# EAGLE design module_tester-v01 (EAGLE 9.6.2)

## Sheet 1 of 4
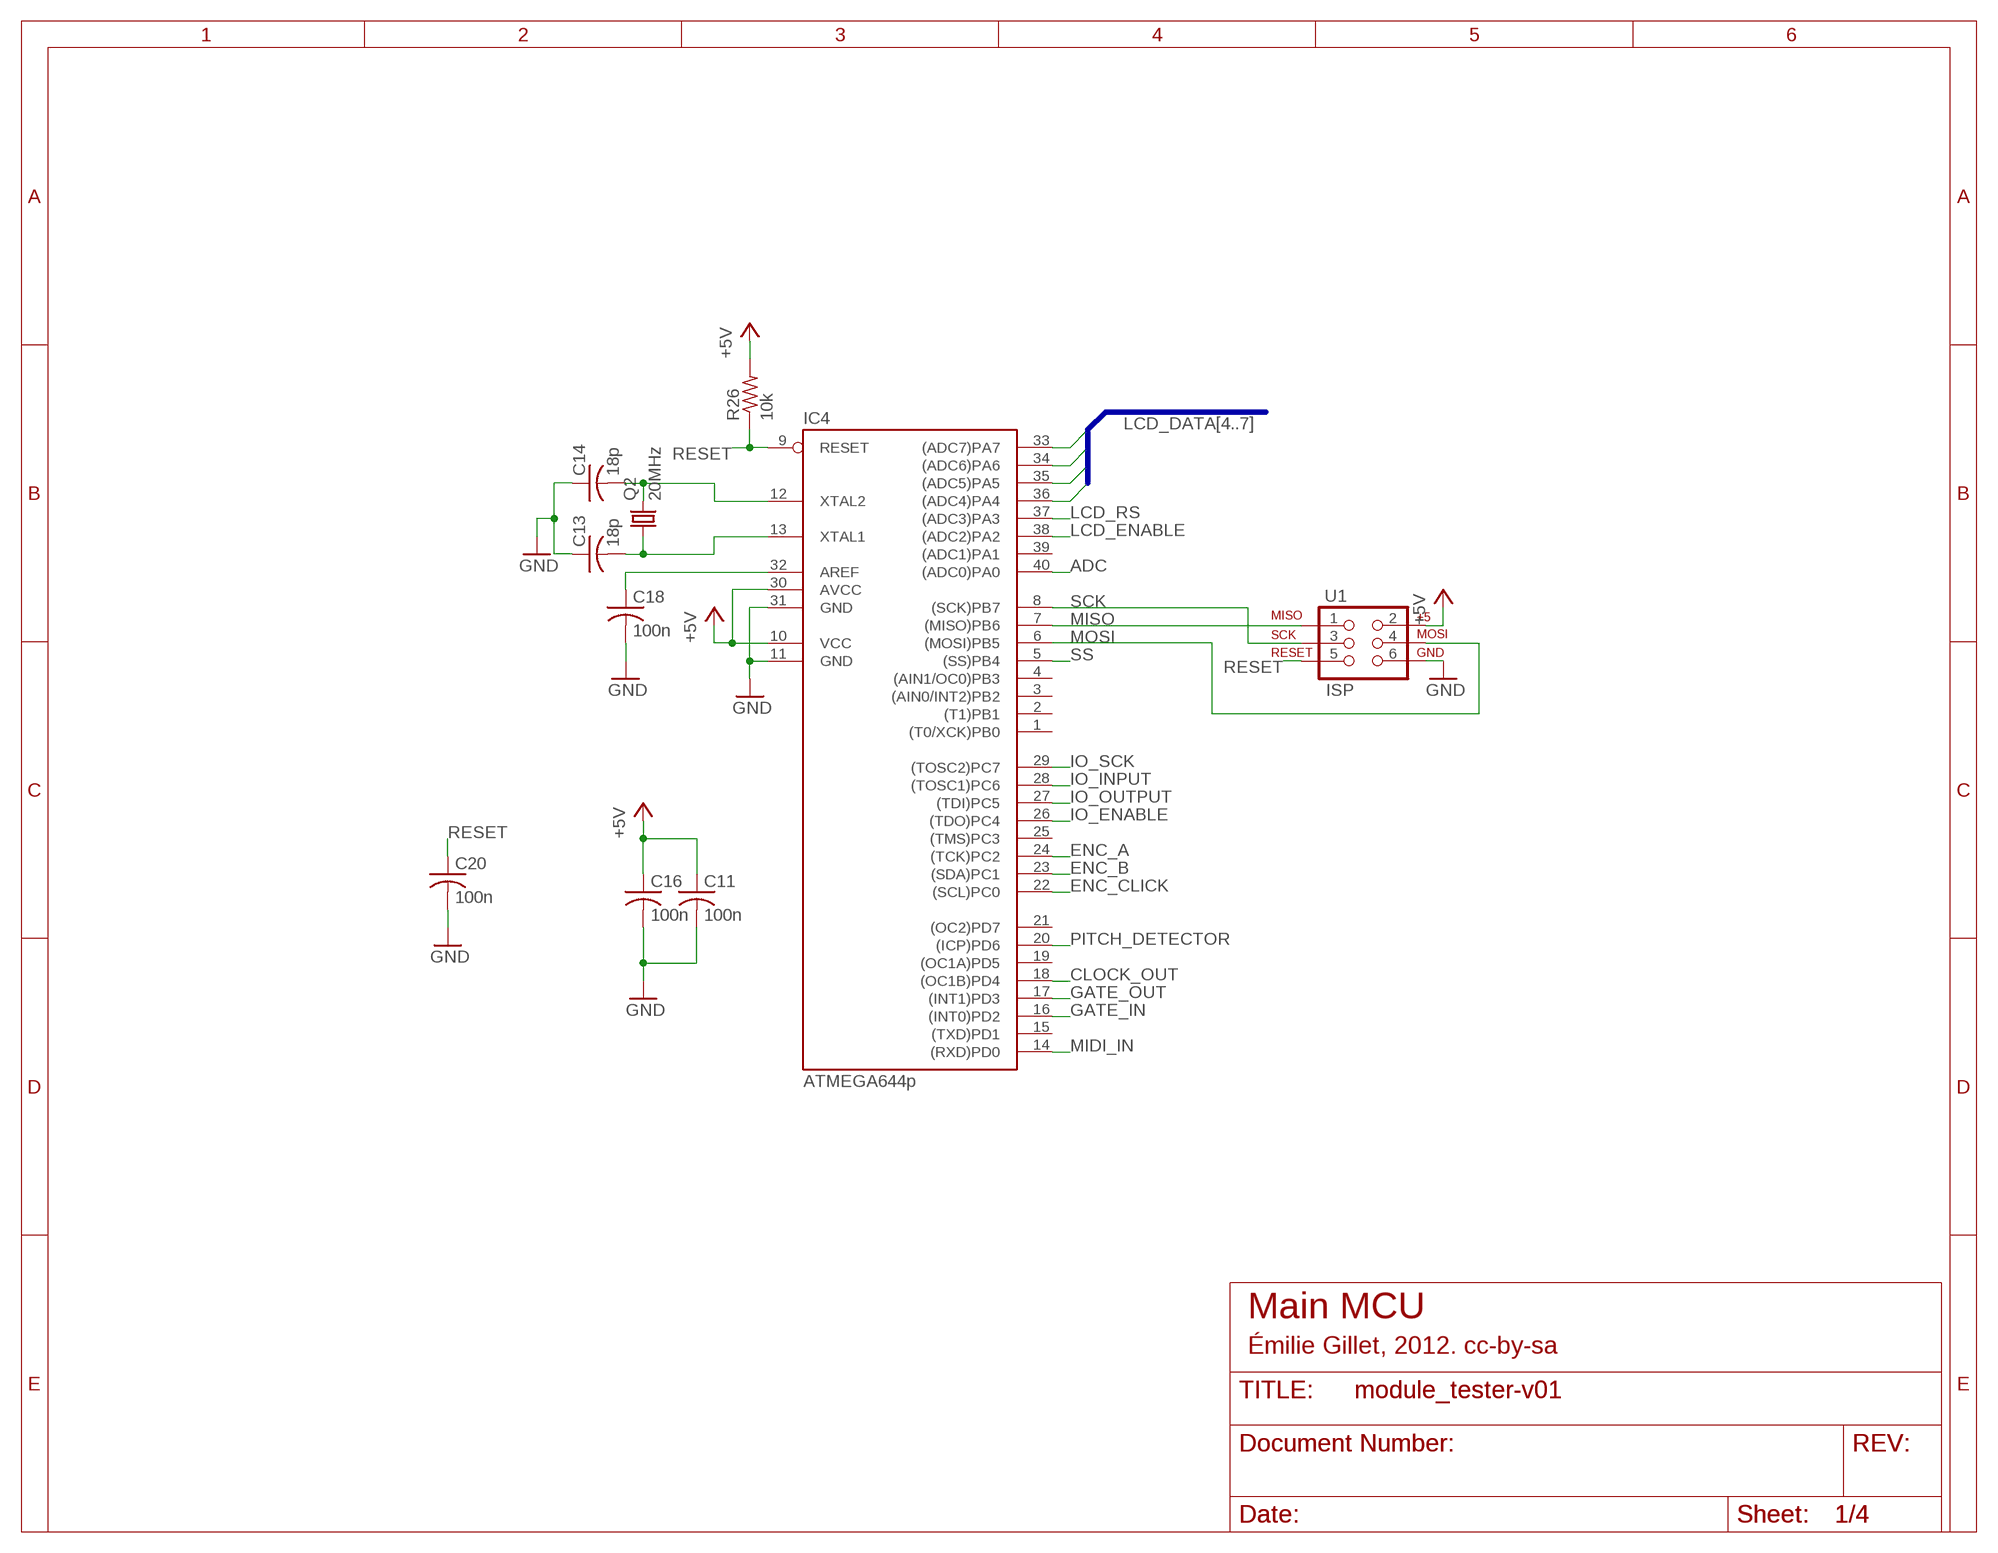
[diagram p0: schematic, sheet 1]

### Parts
C11  100n  C-US025-025X050  [C025-025X050]
C13  18p  C-US025-025X050  [C025-025X050]
C14  18p  C-US025-025X050  [C025-025X050]
C16  100n  C-US025-025X050  [C025-025X050]
C18  100n  C-US025-025X050  [C025-025X050]
C20  100n  C-US025-025X050  [C025-025X050]
IC4  ATMEGA644p  MEGA16-P  [DIL40]
Q2  20MHz  CRYSTALHC49U-V  [HC49U-V]
R26  10k  R-US_0204/7  [0204/7]
U1  ISP  AVR_SPI_PRG_6PTH  [2X3]

### Nets
+5V: C11.1 C16.1 IC4.10(VCC) IC4.30(AVCC) R26.2 U1.2 ; also sheet 2,3,4
ADC: IC4.40((ADC0)PA0) ; also sheet 3
CLOCK_OUT: IC4.18((OC1B)PD4) ; also sheet 2
ENC_A: IC4.24((TCK)PC2) ; also sheet 2
ENC_B: IC4.23((SDA)PC1) ; also sheet 2
ENC_CLICK: IC4.22((SCL)PC0) ; also sheet 2
GATE_IN: IC4.16((INT0)PD2) ; also sheet 2
GATE_OUT: IC4.17((INT1)PD3) ; also sheet 2
GND: C11.2 C13.1 C14.1 C16.2 C18.2 C20.2 IC4.11(GND) IC4.31(GND) U1.6 ; also sheet 2,3,4
IO_ENABLE: IC4.26((TDO)PC4) ; also sheet 2
IO_INPUT: IC4.28((TOSC1)PC6) ; also sheet 2
IO_OUTPUT: IC4.27((TDI)PC5) ; also sheet 2
IO_SCK: IC4.29((TOSC2)PC7) ; also sheet 2
LCD_DATA4: IC4.36((ADC4)PA4) ; also sheet 2
LCD_DATA5: IC4.35((ADC5)PA5) ; also sheet 2
LCD_DATA6: IC4.34((ADC6)PA6) ; also sheet 2
LCD_DATA7: IC4.33((ADC7)PA7) ; also sheet 2
LCD_ENABLE: IC4.38((ADC2)PA2) ; also sheet 2
LCD_RS: IC4.37((ADC3)PA3) ; also sheet 2
MIDI_IN: IC4.14((RXD)PD0) ; also sheet 2
MISO: IC4.7((MISO)PB6) U1.1
MOSI: IC4.6((MOSI)PB5) U1.4 ; also sheet 3
N$7: C18.1 IC4.32(AREF)
N$82: C13.2 IC4.13(XTAL1) Q2.1
N$83: C14.2 IC4.12(XTAL2) Q2.2
PITCH_DETECTOR: IC4.20((ICP)PD6) ; also sheet 3
RESET: C20.1 IC4.9(RESET) R26.1 U1.5
SCK: IC4.8((SCK)PB7) U1.3 ; also sheet 3
SS: IC4.5((SS)PB4) ; also sheet 3
Unconnected: IC4.1((T0/XCK)PB0) IC4.2((T1)PB1) IC4.3((AIN0/INT2)PB2) IC4.4((AIN1/OC0)PB3) IC4.15((TXD)PD1) IC4.19((OC1A)PD5) IC4.21((OC2)PD7) IC4.25((TMS)PC3) IC4.39((ADC1)PA1)

### Buses
LCD_DATA[4..7]

### Notes on the sheet
- Main MCU
- Émilie Gillet, 2012. cc-by-sa

## Sheet 2 of 4
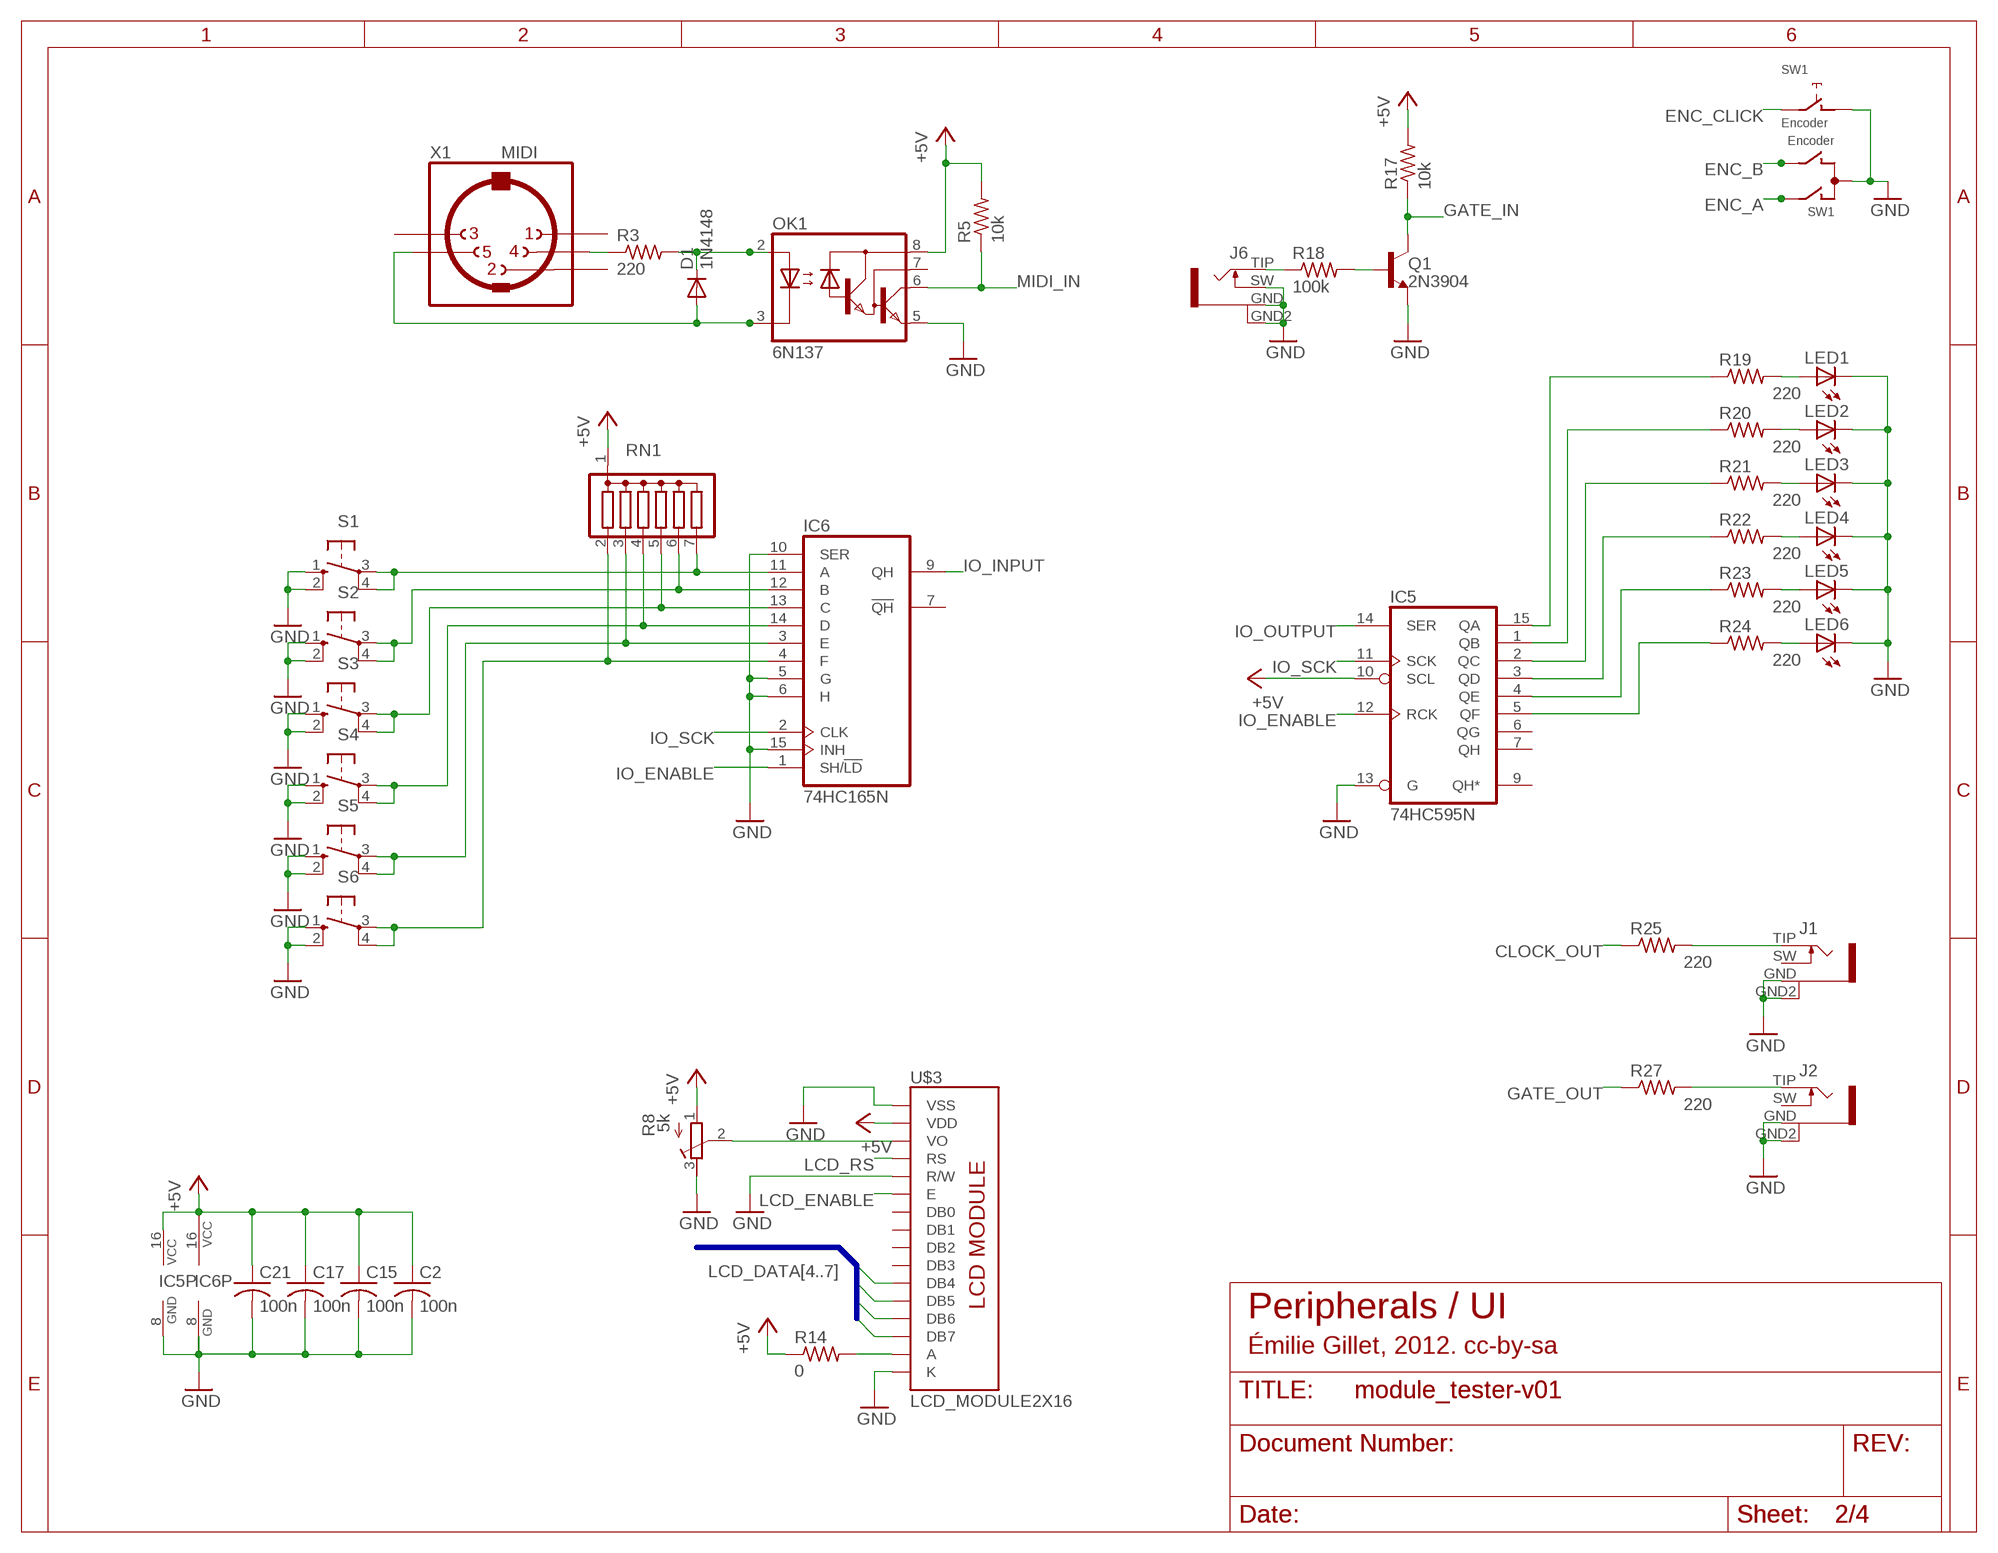
[diagram p1: schematic, sheet 2]

### Parts
C2  100n  C-US025-025X050  [C025-025X050]
C15  100n  C-US025-025X050  [C025-025X050]
C17  100n  C-US025-025X050  [C025-025X050]
C21  100n  C-US025-025X050  [C025-025X050]
D1  1N4148  DIODE-D-5  [D-5]
IC5  74HC595N  [DIL16]
IC6  74HC165N  74LS165N  [DIL16]
J1  PJ301WQP  [WQP_PJ_301BM]
J2  PJ301WQP  [WQP_PJ_301BM]
J6  PJ301WQP  [WQP_PJ_301BM]
LED1  LED3MM  [LED3MM]
LED2  LED3MM  [LED3MM]
LED3  LED3MM  [LED3MM]
LED4  LED3MM  [LED3MM]
LED5  LED3MM  [LED3MM]
LED6  LED3MM  [LED3MM]
OK1  6N137  6N138  [DIL08]
Q1  2N3904  [TO92-]
R3  220  R-US_0204/7  [0204/7]
R5  10k  R-US_0204/7  [0204/7]
R8  5k  R-TRIMM3339P  [RTRIM3339P]
R14  0  R-US_0204/7  [0204/7]
R17  10k  R-US_0204/7  [0204/7]
R18  100k  R-US_0204/7  [0204/7]
R19  220  R-US_0204/7  [0204/7]
R20  220  R-US_0204/7  [0204/7]
R21  220  R-US_0204/7  [0204/7]
R22  220  R-US_0204/7  [0204/7]
R23  220  R-US_0204/7  [0204/7]
R24  220  R-US_0204/7  [0204/7]
R25  220  R-US_0204/7  [0204/7]
R27  220  R-US_0204/7  [0204/7]
RN1  G06R  [SIL7]
S1  40-XX  [B3F-40XX]
S2  40-XX  [B3F-40XX]
S3  40-XX  [B3F-40XX]
S4  40-XX  [B3F-40XX]
S5  40-XX  [B3F-40XX]
S6  40-XX  [B3F-40XX]
SW1  Encoder  EC12E_SW  [ALPS_EC12E_SW]
U$3  LCD_MODULE2X16  [LCD_MODULE_2X16]
X1  MIDI  MAB5SH  [MAB5SH]

### Nets
+5V: C2.1 C15.1 C17.1 C21.1 IC5.10(SCL) IC5.16(VCC) IC6.16(VCC) OK1.8(VCC) R5.2 R8.1(E) R14.1 R17.2 RN1.1 U$3.2(VDD) ; also sheet 1,3,4
CLOCK_OUT: R25.1 ; also sheet 1
ENC_A: SW1.A ; also sheet 1
ENC_B: SW1.B ; also sheet 1
ENC_CLICK: SW1.E ; also sheet 1
GATE_IN: Q1.1(C) R17.1 ; also sheet 1
GATE_OUT: R27.1 ; also sheet 1
GND: C2.2 C15.2 C17.2 C21.2 IC5.8(GND) IC5.13(G) IC6.5(G) IC6.6(H) IC6.8(GND) IC6.10(SER) IC6.15(INH) J1.GND J1.GND2 J2.GND J2.GND2 J6.GND J6.GND2 J6.SW LED1.K(C) LED2.K(C) LED3.K(C) LED4.K(C) LED5.K(C) LED6.K(C) OK1.5(GND) Q1.3(E) R8.3(A) S1.1(S) S1.2(S1) S2.1(S) S2.2(S1) S3.1(S) S3.2(S1) S4.1(S) S4.2(S1) S5.1(S) S5.2(S1) S6.1(S) S6.2(S1) SW1.C SW1.D U$3.1(VSS) U$3.5(R/W) U$3.16(K) ; also sheet 1,3,4
IO_ENABLE: IC5.12(RCK) IC6.1(SH/!LD) ; also sheet 1
IO_INPUT: IC6.9(QH) ; also sheet 1
IO_OUTPUT: IC5.14(SER) ; also sheet 1
IO_SCK: IC5.11(SCK) IC6.2(CLK) ; also sheet 1
LCD_DATA4: U$3.11(DB4) ; also sheet 1
LCD_DATA5: U$3.12(DB5) ; also sheet 1
LCD_DATA6: U$3.13(DB6) ; also sheet 1
LCD_DATA7: U$3.14(DB7) ; also sheet 1
LCD_ENABLE: U$3.6(E) ; also sheet 1
LCD_RS: U$3.4(RS) ; also sheet 1
MIDI_IN: OK1.6(VO) R5.1 ; also sheet 1
N$1: IC5.2(QC) R21.1
N$2: IC5.4(QE) R23.1
N$3: LED5.A R23.2
N$5: J6.TIP R18.1
N$9: IC6.3(E) RN1.3 S5.3(P) S5.4(P1)
N$11: J1.TIP R25.2
N$12: IC6.4(F) RN1.2 S6.3(P) S6.4(P1)
N$13: IC6.14(D) RN1.4 S4.3(P) S4.4(P1)
N$14: J2.TIP R27.2
N$18: R8.2(S) U$3.3(VO)
N$19: LED6.A R24.2
N$21: IC5.5(QF) R24.1
N$24: IC6.11(A) RN1.7 S1.3(P) S1.4(P1)
N$28: D1.C OK1.2(A) R3.2
N$30: IC5.15(QA) R19.1
N$31: IC5.1(QB) R20.1
N$33: IC5.3(QD) R22.1
N$42: LED1.A R19.2
N$43: LED2.A R20.2
N$44: LED3.A R21.2
N$45: LED4.A R22.2
N$66: Q1.2(B) R18.2
N$72: R3.1 X1.4
N$73: D1.A OK1.3(C) X1.5
N$79: R14.2 U$3.15(A)
N$88: IC6.12(B) RN1.6 S2.3(P) S2.4(P1)
N$90: IC6.13(C) RN1.5 S3.3(P) S3.4(P1)
Unconnected: IC5.6(QG) IC5.7(QH) IC5.9(QH*) IC6.7(!QH) J1.SW J2.SW OK1.7(VB) SW1.GND1(G) SW1.GND2(G) U$3.7(DB0) U$3.8(DB1) U$3.9(DB2) U$3.10(DB3) X1.1 X1.2 X1.3

### Buses
LCD_DATA[4..7]

### Notes on the sheet
- Peripherals / UI
- Émilie Gillet, 2012. cc-by-sa

## Sheet 3 of 4
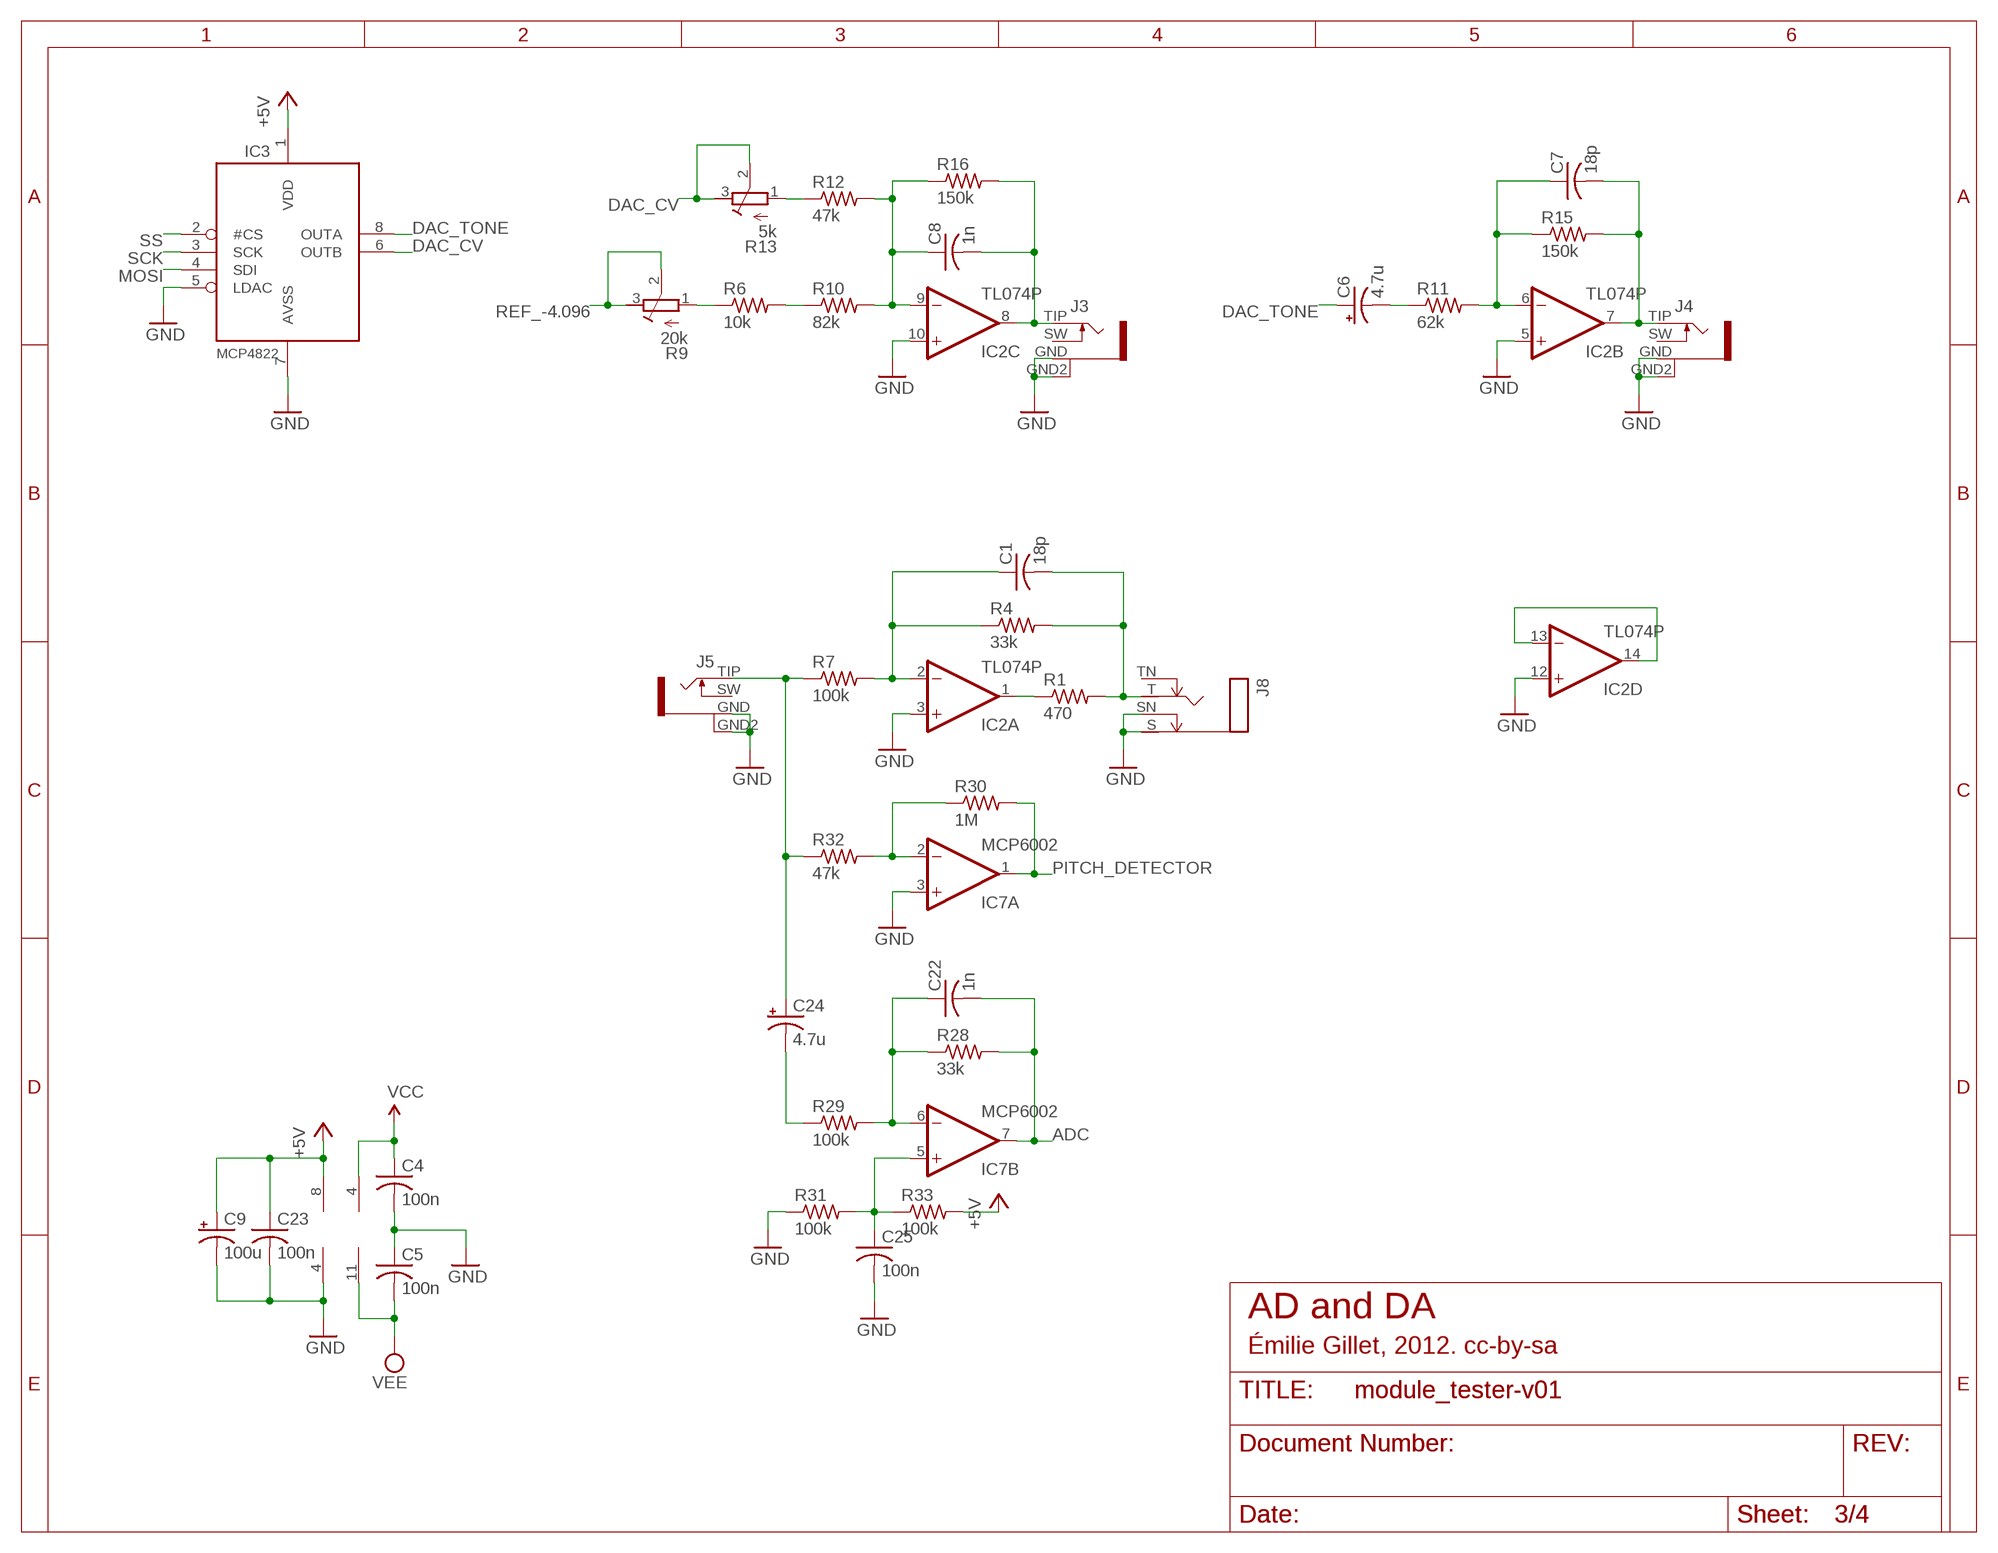
[diagram p2: schematic, sheet 3]

### Parts
C1  18p  C-US025-025X050  [C025-025X050]
C4  100n  C-US025-025X050  [C025-025X050]
C5  100n  C-US025-025X050  [C025-025X050]
C6  4.7u  CPOL-USE2.5-6  [E2,5-6]
C7  18p  C-US025-025X050  [C025-025X050]
C8  1n  C-US025-025X050  [C025-025X050]
C9  100u  CPOL-USE2.5-7  [E2,5-7]
C22  1n  C-US025-025X050  [C025-025X050]
C23  100n  C-US025-025X050  [C025-025X050]
C24  4.7u  CPOL-USE2.5-6  [E2,5-6]
C25  100n  C-US025-025X050  [C025-025X050]
IC2  TL074P  [DIL14]
IC3  MCP4822  [DIL08]
IC7  MCP6002  TL072P  [DIL08]
J3  PJ301WQP  [WQP_PJ_301BM]
J4  PJ301WQP  [WQP_PJ_301BM]
J5  PJ301WQP  [WQP_PJ_301BM]
J8  MONOSWSLIM  [NRJ4HF]
R1  470  R-US_0204/7  [0204/7]
R4  33k  R-US_0204/7  [0204/7]
R6  10k  R-US_0204/7  [0204/7]
R7  100k  R-US_0204/7  [0204/7]
R9  20k  R-TRIMM3296W  [RTRIM3296W]
R10  82k  R-US_0204/7  [0204/7]
R11  62k  R-US_0204/7  [0204/7]
R12  47k  R-US_0204/7  [0204/7]
R13  5k  R-TRIMM3296W  [RTRIM3296W]
R15  150k  R-US_0204/7  [0204/7]
R16  150k  R-US_0204/7  [0204/7]
R28  33k  R-US_0204/7  [0204/7]
R29  100k  R-US_0204/7  [0204/7]
R30  1M  R-US_0204/7  [0204/7]
R31  100k  R-US_0204/7  [0204/7]
R32  47k  R-US_0204/7  [0204/7]
R33  100k  R-US_0204/7  [0204/7]

### Nets
+5V: C9.+ C23.1 IC3.1(VDD) IC7.8(P:V+) R33.2 ; also sheet 1,2,4
ADC: C22.2 IC7.7(B:OUT) R28.2 ; also sheet 1
DAC_CV: IC3.6(OUTB) R13.2(S) R13.3(A)
DAC_TONE: C6.+ IC3.8(OUTA)
GND: C4.2 C5.1 C9.- C23.2 C25.2 IC2.3(A:+IN) IC2.5(B:+IN) IC2.10(C:+IN) IC2.12(D:+IN) IC3.5(LDAC) IC3.7(AVSS) IC7.3(A:+IN) IC7.4(P:V-) J3.GND J3.GND2 J4.GND J4.GND2 J5.GND J5.GND2 J8.S J8.SN R31.1 ; also sheet 1,2,4
MOSI: IC3.4(SDI) ; also sheet 1
N$6: C24.+ J5.TIP R7.1 R32.1
N$15: C1.1 IC2.2(A:-IN) R4.1 R7.2
N$16: C1.2 J8.T R1.2 R4.2
N$17: C6.- R11.1
N$23: C7.1 IC2.6(B:-IN) R11.2 R15.1
N$26: C8.2 IC2.8(C:OUT) J3.TIP R16.2
N$27: C8.1 IC2.9(C:-IN) R10.2 R12.2 R16.1
N$29: R12.1 R13.1(E)
N$32: R6.1 R9.1(E)
N$35: R6.2 R10.1
N$36: C25.1 IC7.5(B:+IN) R31.2 R33.1
N$37: IC7.2(A:-IN) R30.1 R32.2
N$38: C22.1 IC7.6(B:-IN) R28.1 R29.2
N$40: C24.- R29.1
N$41: IC2.13(D:-IN) IC2.14(D:OUT)
N$81: IC2.1(A:OUT) R1.1
PITCH_DETECTOR: IC7.1(A:OUT) R30.2 ; also sheet 1
REF_-4.096: R9.2(S) R9.3(A) ; also sheet 4
SCK: IC3.3(SCK) ; also sheet 1
SS: IC3.2(#CS) ; also sheet 1
TONE_OUT: C7.2 IC2.7(B:OUT) J4.TIP R15.2
VCC: C4.1 IC2.4(P:V+) ; also sheet 4
VEE: C5.2 IC2.11(P:V-) ; also sheet 4
Unconnected: J3.SW J4.SW J5.SW J8.TN

### Notes on the sheet
- AD and DA
- Émilie Gillet, 2012. cc-by-sa

## Sheet 4 of 4
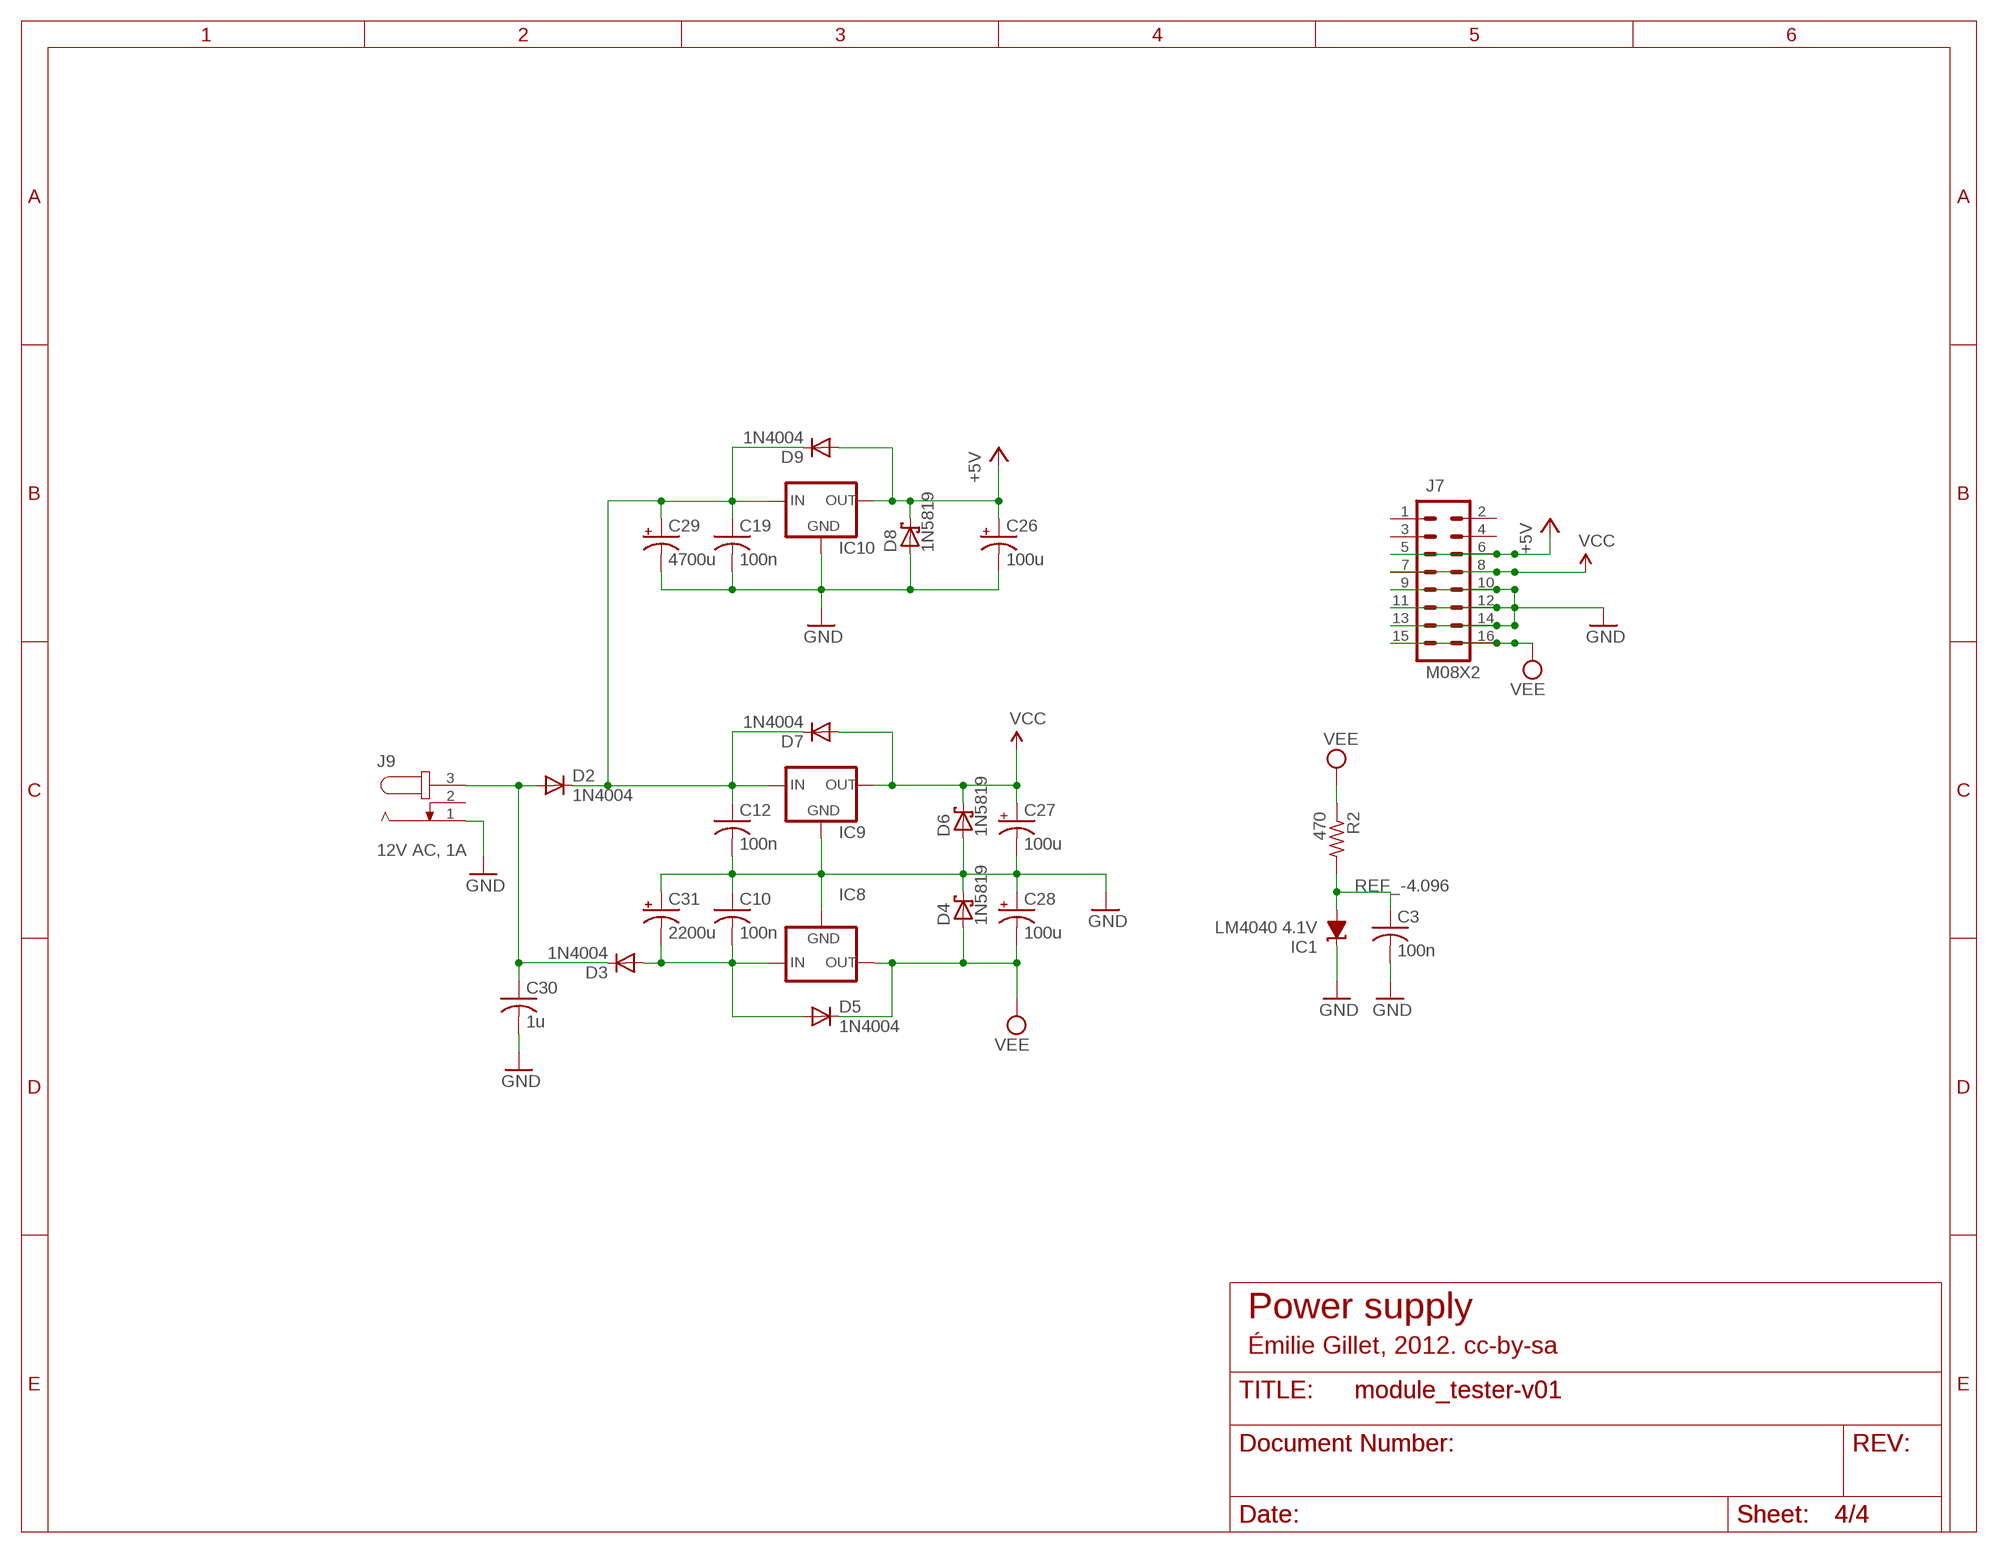
[diagram p3: schematic, sheet 4]

### Parts
C3  100n  C-US025-025X050  [C025-025X050]
C10  100n  C-US025-025X050  [C025-025X050]
C12  100n  C-US025-025X050  [C025-025X050]
C19  100n  C-US025-025X050  [C025-025X050]
C26  100u  CPOL-USE2.5-7  [E2,5-7]
C27  100u  CPOL-USE2.5-7  [E2,5-7]
C28  100u  CPOL-USE2.5-7  [E2,5-7]
C29  4700u  CPOL-USE7.5-16  [E7,5-16]
C30  1u  C-US075-052X106  [C075-052X106]
C31  2200u  CPOL-USE5-13  [E5-13]
D2  1N4004  [DO41-10]
D3  1N4004  [DO41-10]
D4  1N5819  1N5819-T  [DO41-7.6]
D5  1N4004  [DO41-10]
D6  1N5819  1N5819-T  [DO41-7.6]
D7  1N4004  [DO41-10]
D8  1N5819  1N5819-T  [DO41-7.6]
D9  1N4004  [DO41-10]
IC1  LM4040 4.1V  LM4041C12LP  [LP_O-PBCY-W3]
IC8  79XXL  [79XXL]
IC9  78XXL  [78XXL]
IC10  78XXL  [78XXL]
J7  M08X2  [2X8]
J9  JACK-PLUG2  [SPC4078_BIG_HOLES]
R2  470  R-US_0204/7  [0204/7]

### Nets
+5V: C26.+ D8.C D9.A IC10.OUT J7.5 J7.6 ; also sheet 1,2,3
GND: C3.2 C10.1 C12.2 C19.2 C26.- C27.- C28.+ C29.- C30.2 C31.+ D4.C D6.A D8.A IC1.2(C) IC8.GND IC9.GND IC10.GND J7.9 J7.10 J7.11 J7.12 J7.13 J7.14 J9.1 ; also sheet 1,2,3
N$4: C30.1 D2.A D3.C J9.3
N$20: C10.2 C31.- D3.A D5.A IC8.IN
N$25: C12.1 C19.1 C29.+ D2.C D7.C D9.C IC9.IN IC10.IN
REF_-4.096: C3.1 IC1.3(A) R2.2 ; also sheet 3
VCC: C27.+ D6.C D7.A IC9.OUT J7.7 J7.8 ; also sheet 3
VEE: C28.- D4.A D5.C IC8.OUT J7.15 J7.16 R2.1 ; also sheet 3
Unconnected: J7.1 J7.2 J7.3 J7.4 J9.2

### Notes on the sheet
- 12V AC, 1A
- Power supply
- Émilie Gillet, 2012. cc-by-sa

## Library data of the parts
C1-C5 C7 C8 C10-C23 C25 C30 = rcl:C-US: CAPACITOR, American symbol
C6 C9 C24 C26-C29 C31 = rcl:CPOL-US: POLARIZED CAPACITOR, American symbol
D1 = diode:DIODE-: DIODE
D2 D3 D5 D7 D9 = diode:1N4004: DIODE general purpose rectifier, 1 A
D4 D6 D8 = diode:1N581*: 1.0A SCHOTTKY BARRIER RECTIFIER Source: http://www.diodes.com/datasheets/ds23001.pdf
IC1 = texas:LM4041: PRECISION MICROPOWER SHUNT VOLTAGE REFERENCE Source: http://focus.ti.com/lit/ds/slcs146e/slcs146e.pdf
IC2 = linear:TL074: OP AMP
IC3 = og-dac:MCP4822
IC4 = atmel:MEGA16-P: MICROCONTROLLER 16 Kbytes FLASH 1 kbytes SRAM 512 bytes EEPROM USART 8-channel 10 bit ADC Source: avr.lbr
IC5 = 74xx-eu:74*595: 8-bit SHIFT REGISTER, output latch
IC6 = 74xx-us:74*165: 8-bit parallel load SHIFT REGISTER
IC7 = og-linear:TL072: OP AMP
IC8 = v-reg:79XXL: VOLTAGE REGULATOR
IC9 IC10 = v-reg:78XXL: VOLTAGE REGULATOR
J1-J6 = og-pj301:PJ301
J7 = og-header:M08X2
J8 = og-neutrik:MONOSW
J9 = con-jack2:JACK-PLUG: DC POWER JACK Power Jack, DC, Right Angle, Through Hole, Rated 5A at 16VDC, PC Terminals Distributor: Farnell (www.Farnell.de) Drawing: 84N1161.pdf / 84N1162.pdf Manufacturer: SPC Technology (www.spctechnology.com) Type: SPC4077 / SPC 4078
LED1-LED6 = led:LED: LED OSRAM: - CHIPLED LG R971, LG N971, LY N971, LG Q971, LY Q971, LO R971, LY R971 LH N974, LH R974 LS Q976, LO Q976, LY Q976 LO Q996 - Hyper CHIPLED LW Q18S LB Q993, LB Q99A, LB R99A - SideLED LS A670, LO A670, LY A670, LG A670, LP A670 LB A673, LV A673, LT A673, LW A673 LH A674 LY A675 LS A676, LA A676, LO A676, LY A676, LW A676 LS A679, LY A679, LG A679 - Hyper Micro SIDELED® LS Y876, LA Y876, LO Y876, LY Y876 LT Y87S - SmartLED LW L88C, LW L88S LB L89C, LB L89S, LG L890 LS L89K, LO L89K, LY L89K LS L896, LA L896, LO L896, LY L896 - TOPLED LS T670, LO T670, LY T670, LG T670, LP T670 LSG T670, LSP T670, LSY T670, LOP T670, LYG T670 LG T671, LOG T671, LSG T671 LB T673, LV T673, LT T673, LW T673 LH T674 LS T676, LA T676, LO T676, LY T676, LB T676, LH T676, LSB T676, LW T676 LB T67C, LV T67C, LT T67C, LS T67K, LO T67K, LY T67K, LW E67C LS E67B, LA E67B, LO E67B, LY E67B, LB E67C, LV E67C, LT E67C LW T67C LS T679, LY T679, LG T679 LS T770, LO T770, LY T770, LG T770, LP T770 LB T773, LV T773, LT T773, LW T773 LH T774 LS E675, LA E675, LY E675, LS T675 LS T776, LA T776, LO T776, LY T776, LB T776 LHGB T686 LT T68C, LB T68C - Hyper Mini TOPLED® LB M676 - Mini TOPLED Santana® LG M470 LS M47K, LO M47K, LY M47K Source: http://www.osram.convergy.de LUXEON: - LUMILED® LXK2-PW12-R00, LXK2-PW12-S00, LXK2-PW14-U00, LXK2-PW14-V00 LXK2-PM12-R00, LXK2-PM12-S00, LXK2-PM14-U00 LXK2-PE12-Q00, LXK2-PE12-R00, LXK2-PE12-S00, LXK2-PE14-T00, LXK2-PE14-U00 LXK2-PB12-K00, LXK2-PB12-L00, LXK2-PB12-M00, LXK2-PB14-N00, LXK2-PB14-P00, LXK2-PB14-Q00 LXK2-PR12-L00, LXK2-PR12-M00, LXK2-PR14-Q00, LXK2-PR14-R00 LXK2-PD12-Q00, LXK2-PD12-R00, LXK2-PD12-S00 LXK2-PH12-R00, LXK2-PH12-S00 LXK2-PL12-P00, LXK2-PL12-Q00, LXK2-PL12-R00 Source: www.luxeon.com KINGBRIGHT: KA-3528ASYC Source: www.kingbright.com
OK1 = optocoupler:6N138: MOTOROLA OPTO COUPLER
Q1 = gm-trans:2N3904: NPN Transistor
Q2 = crystal:CRYSTAL: CRYSTAL
R1 R3-R7 R10-R12 R14-R33 = rcl:R-US_: RESISTOR, American symbol
R2 = resistor:R-US_: RESISTOR, American symbol
R8 R9 R13 = rcl:R-TRIMM: Trimm resistor
RN1 = resistor-sil:G06R: SIL RESISTOR
S1-S6 = og-switch:40-XX: OMRON SWITCH
SW1 = switch-alps:EC12E_SW: ALPS rotary Encoder EC12E series with switch
U1 = SparkFun:AVR_SPI_PRG_6: AVR ISP 6 Pin This is the reduced ISP connector for AVR programming. Common on Arduino. This footprint will take up less PCB space and can be used with a 10-pin to 6-pin adapter such as SKU: BOB-08508
U$3 = og-lcd:LCD_MODULE: Character LCD module
X1 = og-midi:MAB5SH: Female CONNECTOR 5 pins 90 deg. with shield, horizontal (DIN 41524)

## Board
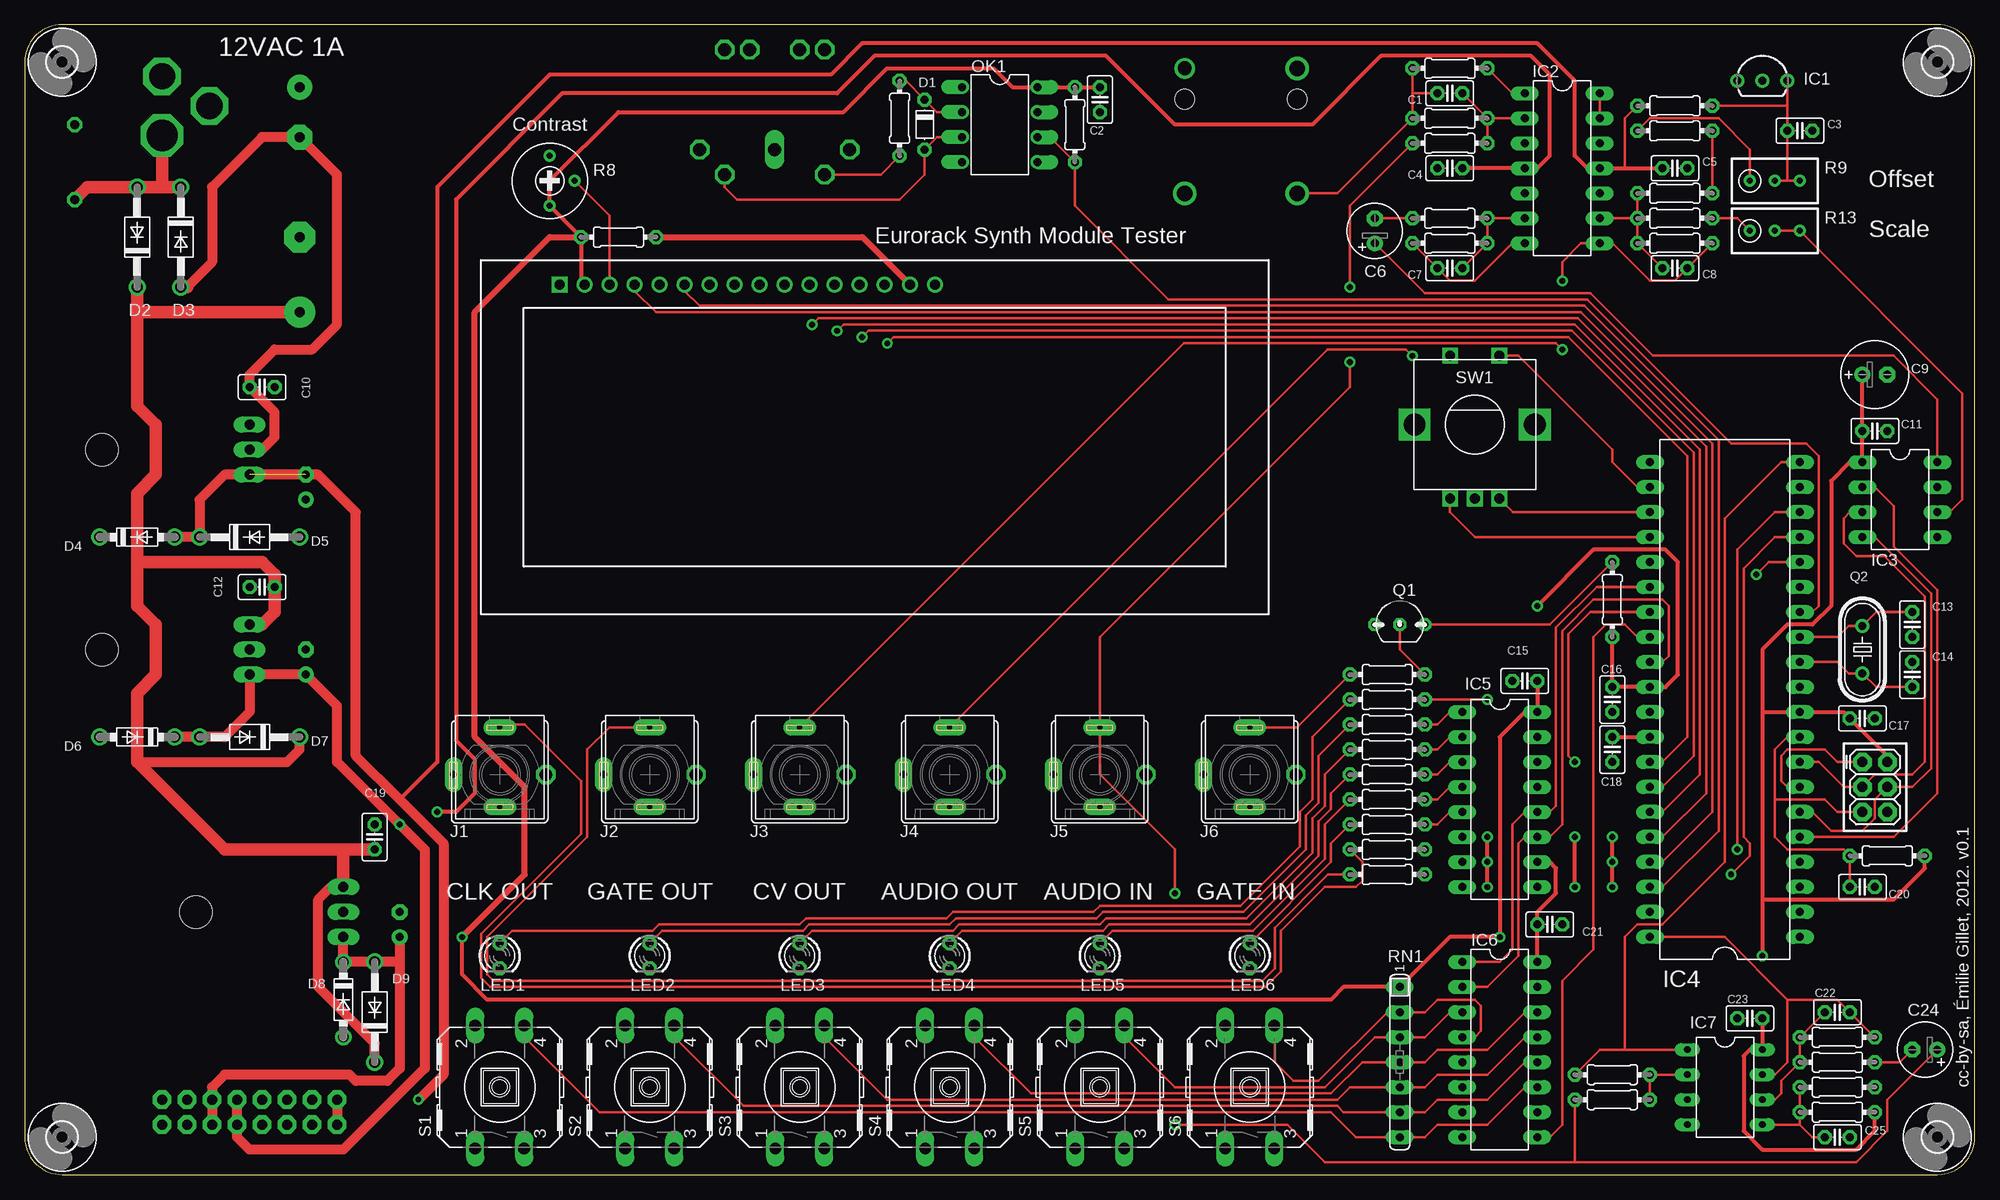
[diagram p4: board, top side]
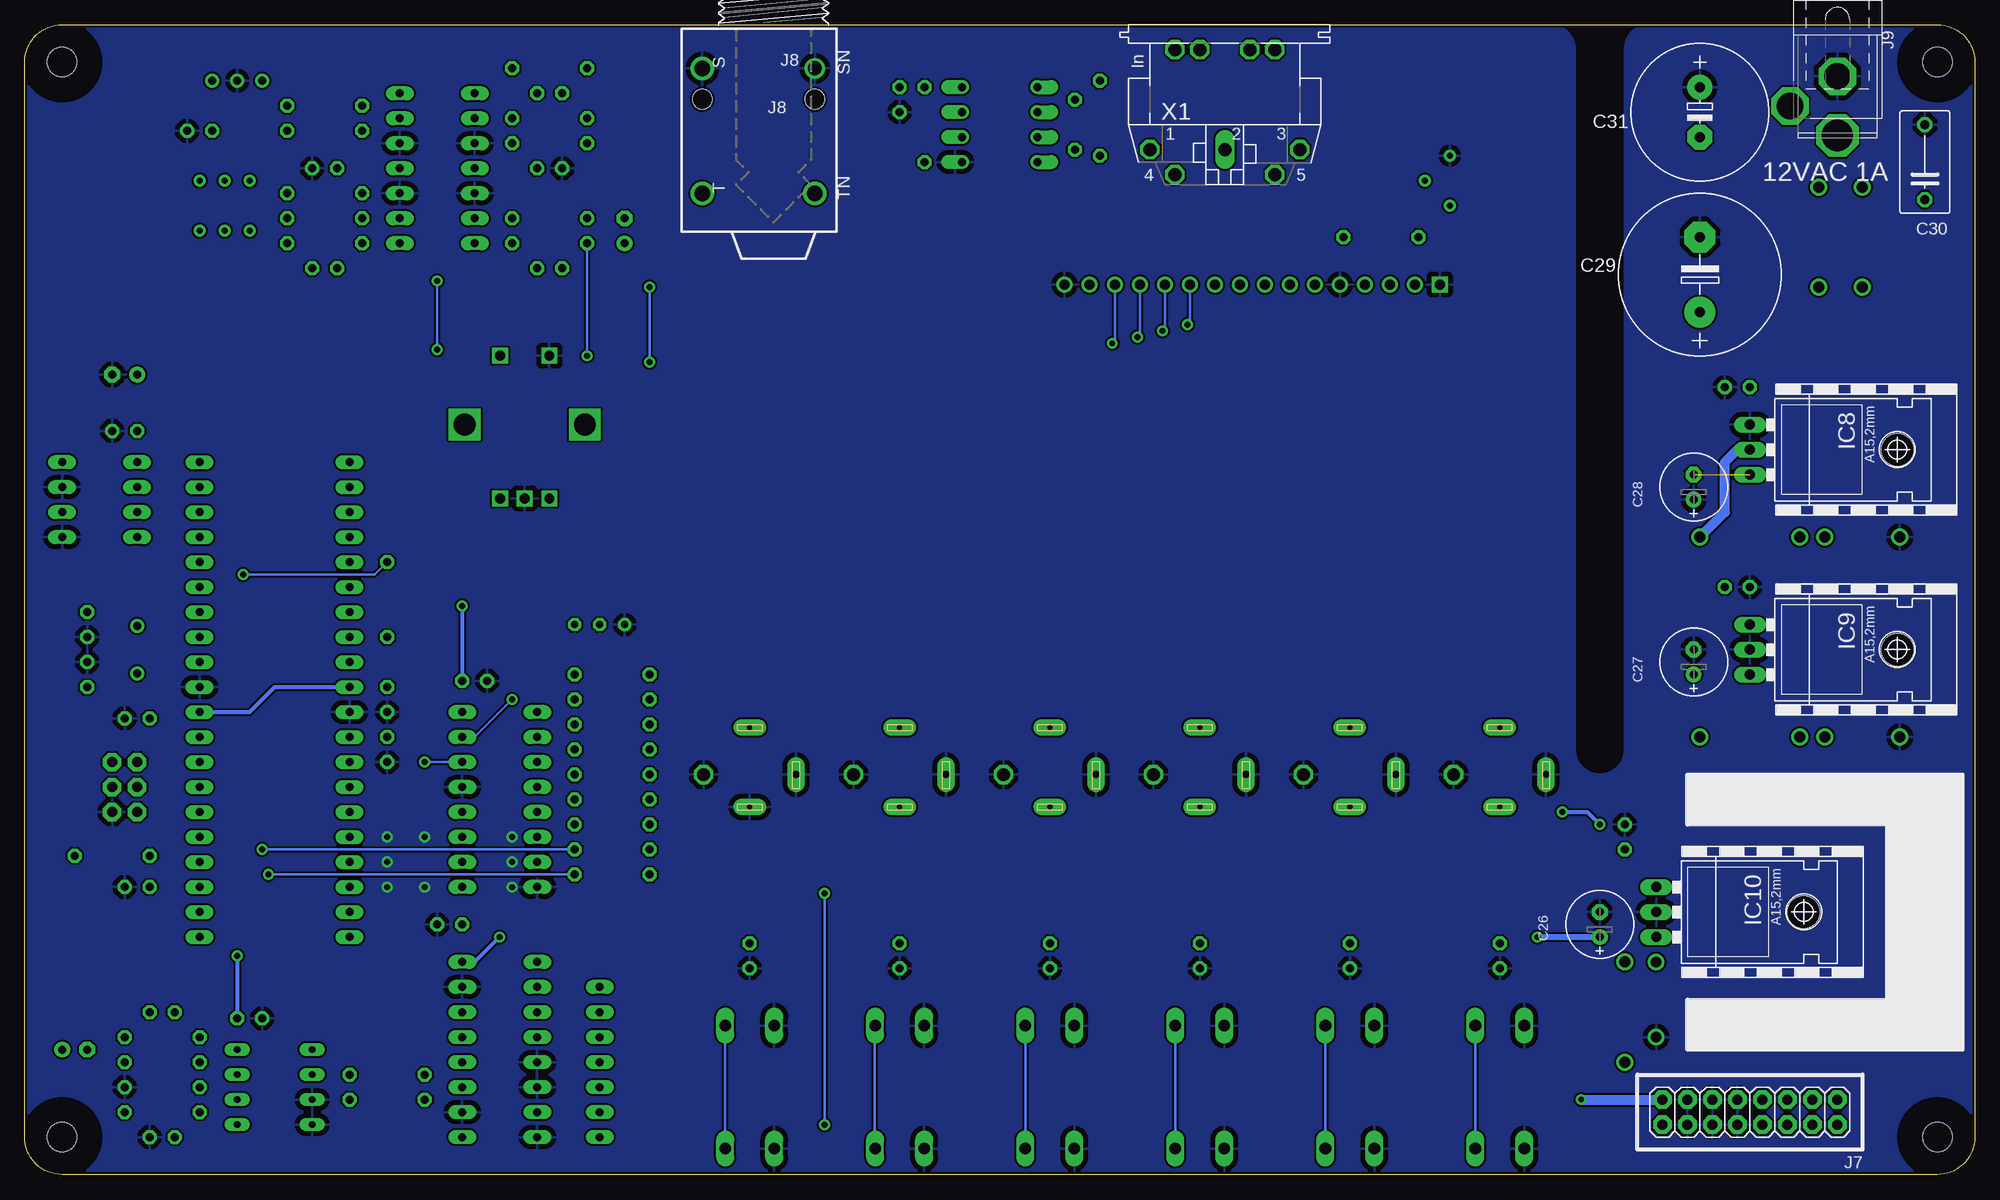
[diagram p5: board, bottom side, seen from below]

Size 198.12 x 116.84 mm. Coordinates in mm from the lower left corner, seen from the top.
Outline: 198.12,113.03 arc90 194.31,116.84 3.81,116.84 arc90 0,113.03 0,3.81 arc90 3.81,0 194.31,0 arc90 198.12,3.81 198.12,113.03
Copper layers (1*16): Top 0.035mm / dielectric 1.5mm / Bottom 0.035mm
Design rules "SparkFun *": minimum track width 8mil, minimum drill 20mil, track to track 8mil, track to pad 8mil, pad to pad 8mil, via to via 8mil, smd to smd 8mil, copper to edge 10mil, drill to drill 8mil, minimum pad ring 12mil, minimum via ring 10mil, stop-mask expansion 4mil, vias tented up to drill 25mil, thermal gap 20mil

### Footprints (pad centres in the part's own frame; a part is rotated, then mirrored left to right if it is on the bottom)
C025-025X050 = drill 0.813 octagon: 1 -1.27,0; 2 1.27,0
E2,5-6 = drill 0.813 pad 1.6: + -1.27,0 | drill 0.813 pad 1.6 octagon: - 1.27,0
E2,5-7 = drill 0.813 pad 1.6: + -1.27,0 | drill 0.813 pad 1.6 octagon: - 1.27,0
E7,5-16 = drill 1.016 pad 3.15: + -3.81,0 | drill 1.016 pad 3.15 octagon: - 3.81,0
C075-052X106 = drill 0.914 octagon: 1 -3.81,0; 2 3.81,0
E5-13 = drill 1.016 pad 2.54: + -2.54,0 | drill 1.016 pad 2.54 octagon: - 2.54,0
D-5 = drill 0.813 octagon: A 2.54,0; C -2.54,0
DO41-10 = drill 1.118: A 5.08,0; C -5.08,0
DO41-7.6 = drill 1.1 pad 1.7: A 3.81,0; C -3.81,0
LP_O-PBCY-W3 = drill 0.8 pad 1.4: 1 -2.54,0; 2 0,0; 3 2.54,0
DIL14 = drill 0.813 long: 1 -7.62,-3.81; 2 -5.08,-3.81; 3 -2.54,-3.81; 4 0,-3.81; 5 2.54,-3.81; 6 5.08,-3.81; 7 7.62,-3.81; 8 7.62,3.81; 9 5.08,3.81; 10 2.54,3.81; 11 0,3.81; 12 -2.54,3.81; 13 -5.08,3.81; 14 -7.62,3.81
DIL08 = drill 0.813 long: 1 -3.81,-3.81; 2 -1.27,-3.81; 3 1.27,-3.81; 4 3.81,-3.81; 5 3.81,3.81; 6 1.27,3.81; 7 -1.27,3.81; 8 -3.81,3.81
DIL40 = drill 0.813 long: 1 -24.13,-7.62; 2 -21.59,-7.62; 3 -19.05,-7.62; 4 -16.51,-7.62; 5 -13.97,-7.62; 6 -11.43,-7.62; 7 -8.89,-7.62; 8 -6.35,-7.62; 9 -3.81,-7.62; 10 -1.27,-7.62; 11 1.27,-7.62; 12 3.81,-7.62; 13 6.35,-7.62; 14 8.89,-7.62; 15 11.43,-7.62; 16 13.97,-7.62; 17 16.51,-7.62; 18 19.05,-7.62; 19 21.59,-7.62; 20 24.13,-7.62; 21 24.13,7.62; 22 21.59,7.62; 23 19.05,7.62; 24 16.51,7.62; 25 13.97,7.62; 26 11.43,7.62; 27 8.89,7.62; 28 6.35,7.62; 29 3.81,7.62; 30 1.27,7.62; 31 -1.27,7.62; 32 -3.81,7.62; 33 -6.35,7.62; 34 -8.89,7.62; 35 -11.43,7.62; 36 -13.97,7.62; 37 -16.51,7.62; 38 -19.05,7.62; 39 -21.59,7.62; 40 -24.13,7.62
DIL16 = drill 0.813 long: 1 -8.89,-3.81; 2 -6.35,-3.81; 3 -3.81,-3.81; 4 -1.27,-3.81; 5 1.27,-3.81; 6 3.81,-3.81; 7 6.35,-3.81; 8 8.89,-3.81; 9 8.89,3.81; 10 6.35,3.81; 11 3.81,3.81; 12 1.27,3.81; 13 -1.27,3.81; 14 -3.81,3.81; 15 -6.35,3.81; 16 -8.89,3.81
DIL08' = drill 0.7 long: 1 -3.81,-3.81; 2 -1.27,-3.81; 3 1.27,-3.81; 4 3.81,-3.81; 5 3.81,3.81; 6 1.27,3.81; 7 -1.27,3.81; 8 -3.81,3.81
79XXL = drill 1.016 long: GND -2.54,-3.81; IN 0,-3.81; OUT 2.54,-3.81 | hole 3.302: 0,11.176
78XXL = drill 1.016 long: GND 0,-3.81; IN -2.54,-3.81; OUT 2.54,-3.81 | hole 3.302: 0,11.176
WQP_PJ_301BM = drill 0.7 pad 1.778 long: GND -4.7,0 | drill 1.3 octagon: GND2 4.7,0 | drill 0.508 pad 1.676 long: SW 0,-3.3; TIP 0,4.8
2X8 = drill 1.016 pad 1.88 octagon: 1 0,0; 2 0,2.54; 3 2.54,0; 4 2.54,2.54; 5 5.08,0; 6 5.08,2.54; 7 7.62,0; 8 7.62,2.54; 9 10.16,0; 10 10.16,2.54; 11 12.7,0; 12 12.7,2.54; 13 15.24,0; 14 15.24,2.54; 15 17.78,0; 16 17.78,2.54
NRJ4HF = drill 1.6: S 5.08,7.992; T -7.62,7.992; TN -7.62,-3.438 | drill 1.4: SN 5.08,-3.438 | hole 2: 1.948,7.992; 1.948,-3.438
SPC4078_BIG_HOLES = drill 2.667 pad 3.81 octagon: 1 -0.46,0; 2 2.54,-4.8 | drill 3.175 pad 4.318 octagon: 3 5.54,0
LED3MM = drill 0.813 octagon: A -1.27,0; K 1.27,0
DIL08'' = drill 0.813 offset: 1 -3.81,-3.81; 2 -1.27,-3.81; 3 1.27,-3.81; 4 3.81,-3.81; 5 3.81,3.81; 6 1.27,3.81; 7 -1.27,3.81; 8 -3.81,3.81
TO92- = drill 0.7 octagon: 1 2.54,0; 2 0,0; 3 -2.54,0
HC49U-V = drill 0.813: 1 -2.413,0; 2 2.413,0
0204/7 = drill 0.813 octagon: 1 -3.81,0; 2 3.81,0
RTRIM3339P = drill 0.61: 1 -2.54,0; 2 0,-2.54; 3 2.54,0
RTRIM3296W = drill 0.61: 1 0,-2.54; 2 0,0; 3 0,2.54
SIL7 = drill 0.813 long: 1 -7.62,0; 2 -5.08,0; 3 -2.54,0; 4 0,0; 5 2.54,0; 6 5.08,0; 7 7.62,0
B3F-40XX = drill 1.194 long: 1 -6.248,2.489; 2 6.248,2.489; 3 -6.248,-2.489; 4 6.248,-2.489
ALPS_EC12E_SW = drill 1 square: A -2.5,-7.5; B 2.5,-7.5; C 0,-7.5; D -2.5,7; E 2.5,7 | drill 2.2 square: GND1 -6.1,0; GND2 6.1,0
2X3 = drill 1.016 pad 1.88 octagon: 1 0,0; 2 0,2.54; 3 2.54,0; 4 2.54,2.54; 5 5.08,0; 6 5.08,2.54
3,0 = hole 3: 0,0
LCD_MODULE_2X16 = drill 1.016 square: 1 -29.46,14.23 | drill 1.016: 2 -26.92,14.23; 3 -24.38,14.23; 4 -21.84,14.23; 5 -19.3,14.23; 6 -16.76,14.23; 7 -14.22,14.23; 8 -11.68,14.23; 9 -9.14,14.23; 10 -6.6,14.23; 11 -4.06,14.23; 12 -1.52,14.23; 13 1.02,14.23; 14 3.56,14.23; 15 6.1,14.23; 16 8.64,14.23
MAB5SH = drill 1.321 octagon: 1 7.62,7.62; 3 -7.62,7.62; 4 5.08,10.16; 5 -5.08,10.16; P$1 -5.08,-2.54; P$2 -2.54,-2.54; P$3 2.54,-2.54; P$4 5.08,-2.54 | drill 1.321 long: 2 0,7.62

### Placement (x,y rotation side)
C1  144.78,109.86 180 top
C2  109.22,109.22 270 top
C3  180.34,106.05 0 top
C4  144.78,102.23 180 top
C5  167.64,102.23 180 top
C6  137.16,95.89 90 top
C7  144.78,92.08 180 top
C8  167.64,92.08 0 top
C9  187.96,81.28 0 top
C10  24.13,80.01 180 top
C11  187.96,75.56 0 top
C12  24.13,59.69 180 top
C13  191.77,55.88 90 top
C14  191.77,50.8 270 top
C15  152.4,50.16 180 top
C16  161.29,48.26 270 top
C17  186.69,46.35 0 top
C18  161.29,43.18 270 top
C19  35.56,34.29 90 top
C20  186.69,29.21 0 top
C21  154.94,25.4 0 top
C22  184.15,16.51 0 top
C23  175.26,15.88 180 top
C24  193.04,12.7 180 top
C25  184.15,3.81 0 top
C26  38.1,25.4 90 bottom
C27  28.57,52.07 90 bottom
C28  28.57,69.85 90 bottom
C29  27.94,91.44 90 bottom
C30  5.08,102.87 90 bottom
C31  27.94,107.95 270 bottom
D1  91.44,106.68 270 top
D2  11.43,95.25 90 top
D3  15.88,95.25 270 top
D4  11.43,64.77 0 top
D5  22.86,64.77 0 top
D6  11.43,44.45 180 top
D7  22.86,44.45 180 top
D8  32.38,17.78 270 top
D9  35.56,16.51 90 top
IC1  176.53,111.12 0 top
IC2  156.21,102.23 270 top
IC3  190.5,68.58 270 top
IC4  172.72,48.26 90 top
IC5  149.86,38.1 270 top
IC6  149.86,12.7 270 top
IC7  MCP6002  [DIL08']  172.72,8.89 270 top
IC8  19.05,73.66 270 bottom
IC9  19.05,53.34 270 bottom
IC10  28.57,26.67 270 bottom
J1  48.26,40.64 0 top
J2  63.5,40.64 0 top
J3  78.74,40.64 0 top
J4  93.98,40.64 0 top
J5  109.22,40.64 0 top
J6  124.46,40.64 0 top
J7  13.97,7.62 180 bottom
J8  121.28,107.31 90 bottom
J9  13.97,111.12 270 bottom
LED1  48.26,22.23 270 top
LED2  63.5,22.23 270 top
LED3  78.74,22.23 270 top
LED4  93.98,22.23 270 top
LED5  109.22,22.23 270 top
LED6  124.46,22.23 270 top
OK1  6N137  [DIL08'']  99.06,106.68 270 top
Q1  139.7,55.88 0 top
Q2  186.69,53.34 270 top
R1  144.78,112.39 180 top
R2  167.64,108.58 0 top
R3  88.9,107.31 90 top
R4  144.78,107.31 180 top
R5  106.68,106.68 90 top
R6  167.64,106.05 0 top
R7  144.78,104.78 0 top
R8  53.34,100.97 90 top
R9  177.8,100.97 270 top
R10  167.64,99.69 180 top
R11  144.78,97.16 0 top
R12  167.64,97.16 180 top
R13  177.8,95.89 270 top
R14  60.33,95.25 0 top
R15  144.78,94.61 180 top
R16  167.64,94.61 0 top
R17  161.29,58.42 270 top
R18  138.43,50.8 0 top
R19  138.43,48.26 180 top
R20  138.43,45.72 180 top
R21  138.43,43.18 180 top
R22  138.43,40.64 180 top
R23  138.43,38.1 180 top
R24  138.43,35.56 180 top
R25  138.43,33.02 180 top
R26  189.23,32.38 0 top
R27  138.43,30.48 180 top
R28  184.15,13.97 0 top
R29  184.15,11.43 180 top
R30  161.29,10.16 180 top
R31  184.15,8.89 180 top
R32  161.29,7.62 0 top
R33  184.15,6.35 0 top
RN1  139.7,11.43 270 top
S1  48.26,8.89 90 top
S2  63.5,8.89 90 top
S3  78.74,8.89 90 top
S4  93.98,8.89 90 top
S5  109.22,8.89 90 top
S6  124.46,8.89 90 top
SW1  147.32,76.2 0 top
U1  186.69,41.91 270 top
U$1  [3,0]  3.81,113.03 0 top
U$2  [3,0]  194.31,113.03 0 top
U$3  83.82,76.2 0 top
U$4  [V2_LOGO_DINGBAT1]  165.1,75.56 0 top
U$5  [3,0]  3.81,3.81 0 top
U$6  [3,0]  194.31,3.81 0 top
U$7  [D02A-L]  22.86,26.67 180 bottom
U$8  [D02A-L]  13.34,53.34 180 bottom
U$9  [D02A-L]  13.34,73.66 180 bottom
X1  76.2,111.76 180 bottom

### Tracks (layer width: path | path; a pad name or v marks a point on that pad's centre or on a via)
+5V  (via drill 0.6)
  Top 0.406: U$3.2 56.52,90.81 R14.1 R8.1 53.34,100.97 60.33,107.95 83.19,107.95 87.63,112.39 98.42,112.39 100.33,110.49 OK1.8 R5.2 C2.1 | R17.2 C16.1 IC4.30 166.69,49.53 167.96,50.8 167.96,62.23 166.69,63.5 159.38,63.5 v153.67,57.78 | C15.1 IC5.16 152.4,46.99 149.86,44.45 v149.86,24.13 144.78,24.13 RN1.1 133.99,19.05 132.72,17.78 46.99,17.78 44.45,20.32 v44.45,24.13 | IC6.16 C21.1 153.67,26.67 155.57,28.57 155.57,31.11 154.94,31.75 IC5.10 | C23.1 IC7.8 175.26,12.7 174.62,12.06 174.62,4.45 176.53,2.54 186.06,2.54 187.96,4.45 R33.2 | U1.2 189.23,42.55 C17.1 184.78,46.99 IC4.10 176.53,46.99 | R26.2 193.04,31.11 189.87,27.94 176.53,27.94 | 176.53,46.99 176.53,27.94 | 176.53,27.94 v176.53,22.23 | 176.53,46.99 176.53,53.34 179.07,55.88 181.61,55.88 183.51,57.78 183.51,70.48 185.42,72.39 IC3.1 C11.1 C9.+
  Top 0.61: R14.1 53.34,95.25 45.72,87.63 45.72,44.45 50.8,39.37 50.8,30.48 v44.45,24.13
  Top 1.016: IC10.OUT D8.C D9.A 38.1,21.59 | C26.+ 38.1,21.59 | 38.1,21.59 38.1,10.79 36.83,9.53 33.66,9.53 33.02,10.16 20.32,10.16 19.05,8.89 J7.5 J7.6
  Bottom 0.406: IC4.10 175.26,46.99 172.72,49.53 IC4.30 | IC6.16 152.4,21.59 v149.86,24.13 | v176.53,22.23 C23.1 | v153.67,57.78 C15.1
  Bottom 0.61: v44.45,24.13 C26.+
ADC
  Top 0.254: IC7.7 177.8,10.16 179.07,11.43 179.07,17.78 | IC4.40 172.72,24.13 179.07,17.78 | 179.07,17.78 184.15,17.78 C22.2 R28.2
CLOCK_OUT  (via drill 0.6)
  Top 0.254: IC4.18 177.8,67.31 173.99,63.5 v173.99,33.02
  Bottom 0.254: R25.1 v173.99,33.02
DAC_CV
  Top 0.254: R13.2 R13.3 196.85,79.38 196.85,68.58 195.58,67.31 IC3.6
DAC_TONE
  Top 0.254: C6.+ 142.24,89.53 159.07,89.53 165.42,83.19 189.87,83.19 194.31,78.74 IC3.8
ENC_A
  Top 0.254: SW1.A 144.78,68.66 144.78,67.31 147.32,64.77 IC4.24
ENC_B
  Top 0.254: SW1.B 151.21,67.31 IC4.23
ENC_CLICK
  Top 0.254: SW1.E 149.84,83.19 151.76,83.19 161.29,73.66 161.29,72.39 163.83,69.85 IC4.22
GATE_IN  (via drill 0.6)
  Top 0.254: Q1.1 154.94,55.88 R17.1 | v175.9,60.96 177.16,62.23 IC4.16
  Bottom 0.254: R17.1 162.56,60.96 v175.9,60.96
GATE_OUT  (via drill 0.6)
  Top 0.254: IC4.17 177.8,64.77 174.62,61.59 174.62,34.29 175.26,33.66 175.26,32.38 v173.35,30.48
  Bottom 0.254: R27.1 147.96,30.48 v173.35,30.48
GND  (via drill 0.6)
  Top 0.406: v157.48,29.21 v157.48,34.29 | v161.29,29.21 v161.29,31.75 v161.29,34.29 | v148.59,29.21 v148.59,31.75 v148.59,34.29
  pour Bottom: 0,116.84 33.02,116.84 arc-90 35.56,114.3 35.56,43.18 arc90 38.1,40.64 arc90 40.64,43.18 40.64,114.3 arc-90 43.18,116.84 198.12,116.84 198.12,0 0,0
IO_ENABLE
  Top 0.254: IC4.26 159.7,59.69 155.57,55.56 155.57,37.47 154.94,36.83 IC5.12 152.4,36.83 151.13,35.56 151.13,22.86 149.86,21.59 IC6.1
IO_INPUT
  Top 0.254: IC4.28 163.83,54.61 162.56,55.88 160.66,55.88 159.38,54.61 159.38,22.86 156.21,19.68 156.21,5.08 154.94,3.81 IC6.9
IO_OUTPUT  (via drill 0.6)
  Top 0.254: v157.48,41.91 156.84,42.55 156.84,54.93 159.07,57.15 IC4.27
  Bottom 0.254: IC5.14 v157.48,41.91
IO_SCK
  Top 0.254: IC4.29 166.37,52.07 167,52.7 167,57.78 166.37,58.42 159.38,58.42 156.21,55.24 156.21,35.56 154.94,34.29 IC5.11 152.4,34.29 151.76,33.66 151.76,22.23 148.59,19.05 IC6.2
LCD_DATA4  (via drill 0.6)
  Top 0.254: IC4.36 166.37,34.29 170.81,38.73 170.81,73.98 157.8,87 80.64,87 v80.01,86.36
  Bottom 0.254: v80.01,86.36 79.76,86.61 U$3.11
LCD_DATA5  (via drill 0.6)
  Top 0.254: IC4.35 166.37,36.83 170.18,40.64 170.18,73.66 157.48,86.36 83.19,86.36 v82.55,85.72
  Bottom 0.254: v82.55,85.72 82.3,85.97 U$3.12
LCD_DATA6  (via drill 0.6)
  Top 0.254: IC4.34 166.37,39.37 169.54,42.55 169.54,73.34 157.16,85.72 85.72,85.72 v85.09,85.09
  Bottom 0.254: v85.09,85.09 84.84,85.34 U$3.13
LCD_DATA7  (via drill 0.6)
  Top 0.254: IC4.33 166.37,41.91 168.91,44.45 168.91,73.03 156.84,85.09 88.27,85.09 v87.63,84.45
  Bottom 0.254: v87.63,84.45 87.38,84.7 U$3.14
LCD_ENABLE
  Top 0.254: IC4.38 166.37,29.21 172.09,34.92 172.09,74.61 158.43,88.27 68.58,88.27 67.06,89.78 U$3.6
LCD_RS
  Top 0.254: IC4.37 166.37,31.75 171.45,36.83 171.45,74.3 158.12,87.63 64.14,87.63 61.98,89.78 U$3.4
MIDI_IN
  Top 0.254: OK1.6 104.14,105.41 R5.1 106.68,98.42 116.2,88.9 158.75,88.9 173.35,74.3 180.97,74.3 182.25,73.03 182.25,57.78 181.61,57.15 IC4.14
MISO
  Top 0.254: IC4.7 179.07,39.37 178.44,40.01 178.44,42.55 179.07,43.18 182.88,43.18 184.15,41.91 U1.1
MOSI
  Top 0.254: IC4.6 181.61,36.83 183.51,34.92 186.69,34.92 187.96,36.2 187.96,38.1 U1.4 191.77,39.37 193.68,41.27 193.68,59.05 187.96,64.77 IC3.4
N$1
  Top 0.254: R21.1 143.51,43.18 144.78,44.45 IC5.2
N$2
  Top 0.254: R23.1 143.51,38.1 144.78,39.37 IC5.4
N$3
  Top 0.254: R23.2 132.08,35.56 132.08,32.07 124.78,24.77 110.49,24.77 LED5.A
N$4
  Top 1.27: 13.97,100.33 D2.A 6.35,100.33 C30.1 | 13.97,100.33 D3.C | 13.97,100.33 J9.3
N$5
  Top 0.254: R18.1 129.26,45.44 J6.TIP
N$6  (via drill 0.6)
  Top 0.254: C24.+ 189.23,7.62 189.23,4.45 186.06,1.27 157.48,1.27 | 157.48,1.27 R32.1 | 157.48,1.27 132.08,1.27 128.27,5.08 v116.84,5.08 | v116.84,28.57 116.84,33.02 109.22,40.64 J5.TIP 109.22,54.61 134.62,80.01 v134.62,82.55 | R7.1 134.62,98.42 v134.62,90.17
  Bottom 0.254: v116.84,5.08 v116.84,28.57 | v134.62,82.55 v134.62,90.17
N$7
  Top 0.406: C18.1 IC4.32
N$9
  Top 0.254: S5.4 111.76,15.09 111.76,13.97 116.84,8.89 132.08,8.89 137.16,13.97 RN1.3 142.24,13.97 144.78,16.51 IC6.3
  Bottom 0.254: S5.3 111.76,2.69 111.76,14.61 111.71,14.66 S5.4
N$11
  Top 0.254: J1.TIP 48.54,45.72 50.8,45.72 56.52,40.01 56.52,34.61 46.35,24.45 46.35,20 47.31,19.05 126.05,19.05 127.64,20.64 127.64,24.77 132.08,29.21 135.25,29.21 135.89,29.84 135.89,31.75 R25.2
N$12
  Top 0.254: S6.4 127,15.09 127,11.43 128.91,9.53 131.44,9.53 138.43,16.51 RN1.2 142.24,16.51 143.51,17.78 147.32,17.78 147.96,17.14 147.96,14.61 147.32,13.97 IC6.4
  Bottom 0.254: S6.3 S6.4
N$13
  Top 0.254: S4.4 96.52,15.09 96.52,13.97 102.23,8.26 132.72,8.26 135.89,11.43 RN1.4 142.24,11.43 143.51,12.7 148.59,12.7 152.4,16.51 IC6.14
  Bottom 0.254: S4.3 S4.4
N$14
  Top 0.254: J2.TIP 59.41,45.44 57.15,43.18 57.15,34.29 46.99,24.13 46.99,20.32 47.62,19.68 125.73,19.68 127,20.95 127,25.08 132.4,30.48 R27.2
N$15
  Top 0.254: R4.1 R7.2 | C1.1 R4.1 | R4.1 IC2.2
N$16
  Top 0.254: 140.97,109.86 R1.2 | 140.97,109.86 R4.2 133.35,99.69 J8.T | 140.97,109.86 C1.2
N$17
  Top 0.254: C6.- R11.1
N$18
  Top 0.254: R8.2 59.44,97.41 U$3.3
N$19
  Top 0.254: R24.2 132.72,33.66 132.72,31.75 LED6.A
N$20
  Top 1.016: 16.51,90.17 19.05,92.71 19.05,100.33 24.13,105.41 C31.- 31.75,101.6 31.75,86.36 29.21,83.82 25.4,83.82 22.86,81.28 C10.2 25.4,77.47 25.4,74.93 24.13,73.66 IC8.IN
  Top 1.27: 16.51,90.17 D3.A
  Bottom 1.016: D5.A 25.4,67.31 25.4,72.39 24.13,73.66 IC8.IN
N$21
  Top 0.254: R24.1 143.51,35.56 144.78,36.83 IC5.5
N$23
  Top 0.254: IC2.6 R11.2 R15.1 C7.1
N$24
  Top 0.254: S1.4 50.8,15.09 50.8,13.97 58.42,6.35 132.72,6.35 135.25,3.81 RN1.7 142.24,3.81 143.51,5.08 148.59,5.08 152.4,8.89 IC6.11
  Bottom 0.254: S1.3 S1.4
N$25
  Top 1.016: D7.C 27.94,43.18 26.67,41.91 11.43,41.91 | IC10.IN 31.11,29.21 29.84,27.94 29.84,19.05 35.56,13.34 D9.C
  Top 1.27: 11.43,62.23 11.43,57.78 13.34,55.88 13.34,50.8 11.43,48.9 11.43,41.91 20.32,33.02 32.38,33.02 | 11.43,62.23 11.43,69.22 13.34,71.12 13.34,76.2 11.43,78.11 11.43,87.63 | 11.43,87.63 D2.C | 32.38,33.02 C19.1 | IC10.IN 32.38,33.02 | 11.43,87.63 C29.+ | 11.43,62.23 24.13,62.23 25.4,60.96 C12.1 25.4,57.15 24.13,55.88 IC9.IN
N$26  (via drill 0.6)
  Top 0.254: R16.2 C8.2 167.64,90.81 165.1,90.81 161.29,94.61 IC2.8 158.12,94.61 156.21,92.71 v156.21,90.81 | J3.TIP 117.75,84.45 155.57,84.45 v156.21,83.82
  Bottom 0.254: v156.21,90.81 v156.21,83.82
N$27
  Top 0.254: R12.2 R10.2 | R12.2 IC2.9 | R12.2 R16.1 C8.1
N$28
  Top 0.254: OK1.2 92.71,107.95 D1.C 89.53,111.12 R3.2
N$29
  Top 0.254: R13.1 173.99,97.16 R12.1
N$30  (via drill 0.6)
  Top 0.254: R19.1 v148.59,48.26
  Bottom 0.254: v148.59,48.26 152.4,44.45 IC5.15
N$31
  Top 0.254: R20.1 143.51,45.72 144.78,46.99 IC5.1
N$32
  Top 0.254: R6.1 165.1,107.31 172.09,107.31 175.26,104.14 R9.1
N$33
  Top 0.254: R22.1 143.51,40.64 144.78,41.91 IC5.3
N$35
  Top 0.254: R10.1 R6.2
N$36
  Top 0.254: R31.2 R33.1 180.34,5.08 | 180.34,5.08 181.61,3.81 C25.1 | IC7.5 180.34,5.08
N$37
  Top 0.254: R32.2 R30.1 IC7.2
N$38
  Top 0.254: IC7.6 177.8,7.62 178.44,8.26 178.44,9.53 R29.2 R28.1 C22.1
N$40
  Top 0.254: R29.1 190.5,11.43 C24.-
N$41
  Top 0.254: IC2.13 IC2.14
N$42
  Top 0.254: R19.2 130.81,44.45 130.81,38.1 129.54,36.83 129.54,33.34 123.51,27.3 109.22,27.3 108.58,26.67 94.3,26.67 93.66,26.04 79.38,26.04 78.74,25.4 64.45,25.4 63.82,24.77 49.53,24.77 LED1.A
N$43
  Top 0.254: LED2.A 64.77,24.77 79.06,24.77 79.69,25.4 93.98,25.4 94.61,26.04 108.9,26.04 109.54,26.67 123.83,26.67 130.18,33.02 130.18,36.51 131.44,37.78 131.44,42.55 R20.2
N$44
  Top 0.254: R21.2 132.08,40.64 132.08,37.47 130.81,36.2 130.81,32.7 124.14,26.04 109.86,26.04 109.22,25.4 94.93,25.4 94.3,24.77 80.01,24.77 LED3.A
N$45
  Top 0.254: R22.2 132.72,38.73 132.72,37.15 131.44,35.88 131.44,32.38 124.46,25.4 110.17,25.4 109.54,24.77 95.25,24.77 LED4.A
N$66
  Top 0.254: R18.2 139.7,53.34 Q1.2
N$72
  Top 0.254: R3.1 87,101.6 X1.4
N$73
  Top 0.254: X1.5 71.12,100.33 72.39,99.06 88.9,99.06 91.44,101.6 D1.A 92.71,105.41 OK1.3
N$79
  Top 0.61: U$3.15 85.1,95.25 R14.2
N$81
  Top 0.254: IC2.1 151.13,109.86 R1.1
N$82
  Top 0.254: IC4.13 184.15,54.61 185.29,55.75 Q2.1 188.09,57.15 C13.2
N$83
  Top 0.254: IC4.12 184.15,52.07 185.29,50.93 Q2.2 188.09,49.53 C14.2
N$88
  Top 0.254: S2.4 66.04,15.09 66.04,13.97 73.03,6.99 133.35,6.99 133.99,6.35 RN1.6 142.24,6.35 143.51,7.62 148.59,7.62 152.4,11.43 IC6.12
  Bottom 0.254: S2.3 S2.4
N$90
  Top 0.254: S3.4 81.28,15.09 81.28,13.97 87.63,7.62 133.35,7.62 134.62,8.89 RN1.5 142.24,8.89 143.51,10.16 148.59,10.16 152.4,13.97 IC6.13
  Bottom 0.254: S3.3 S3.4
PITCH_DETECTOR
  Top 0.254: R30.2 160.02,12.7 162.56,12.7 | 162.56,12.7 IC7.1 | IC4.20 178.44,72.39 172.72,66.67 172.72,31.75 166.37,25.4 163.83,25.4 162.56,24.13 162.56,12.7
REF_-4.096
  Top 0.254: 179.07,108.58 C3.1 179.07,100.97 | 179.07,108.58 IC1.3 | 179.07,108.58 R2.2 | R9.2 179.07,100.97 | 179.07,100.97 R9.3
RESET
  Top 0.254: U1.5 184.15,36.83 182.88,38.1 177.8,38.1 | 177.8,38.1 177.8,43.18 179.07,44.45 IC4.9 | 177.8,38.1 177.8,34.29 179.07,33.02 184.78,33.02 R26.1 C20.1
SCK
  Top 0.254: IC4.8 182.25,41.91 184.78,39.37 U1.3 187.96,40.64 191.77,40.64 193.04,41.91 193.04,58.74 188.91,62.87 186.06,62.87 184.78,64.14 184.78,66.67 185.42,67.31 IC3.3
SS
  Top 0.254: IC4.5 189.87,34.29 194.31,38.73 194.31,59.37 189.87,63.82 189.87,67.94 187.96,69.85 IC3.2
TONE_OUT  (via drill 0.6)
  Top 0.254: R15.2 C7.2 144.78,90.81 147.32,90.81 151.13,94.61 IC2.7 | J4.TIP 132.36,83.82 140.34,83.82 v140.97,83.19
  Bottom 0.254: v140.97,83.19 R15.2
VCC  (via drill 0.6)
  Top 0.406: C4.1 IC2.4 153.67,102.23 154.94,103.5 154.94,111.76 153.03,113.67 137.79,113.67 130.81,106.68 116.84,106.68 109.86,113.67 86.36,113.67 82.55,109.86 54.61,109.86 43.81,99.06 43.81,44.13 45.72,42.23 45.72,38.73 43.81,36.83 v41.91,36.83
  Top 1.016: D6.C D7.A 20.32,44.45 22.86,46.99 IC9.OUT C27.+ 31.75,47.62 31.75,41.91 v38.1,35.56 40.64,33.02 40.64,10.79 32.38,2.54 22.86,2.54 21.59,3.81 J7.8 J7.7
  Bottom 0.406: v38.1,35.56 39.37,36.83 v41.91,36.83
VEE  (via drill 0.6)  (1 unrouted)
  Top 0.254: R2.1 162.56,107.31 162.56,102.23
  Top 0.406: C5.2 162.56,102.23 IC2.11 158.75,102.23 157.48,103.5 157.48,111.12 153.67,114.94 85.09,114.94 81.92,111.76 53.34,111.76 41.91,100.33 41.91,41.91 38.1,38.1
  Top 1.016: D4.A D5.C 17.78,68.58 20.32,71.12 C28.- 29.84,71.12 33.66,67.31 33.66,42.55 38.1,38.1 42.55,33.66 42.55,10.16 v40.01,7.62 | J7.15 J7.16
  Bottom 1.016: v40.01,7.62 J7.15

### Text on the board
tNames: 12VAC 1A | Contrast | Offset | Eurorack Synth Module Tester | Scale | CLK OUT | GATE OUT | CV OUT | AUDIO OUT | AUDIO IN | GATE IN | cc-by-sa, Émilie Gillet, 2012. v0.1
bNames: In | 12VAC 1A